# EAGLE design HABEXpico8 (EAGLE 9.1.3)

## Sheet 1 of 5
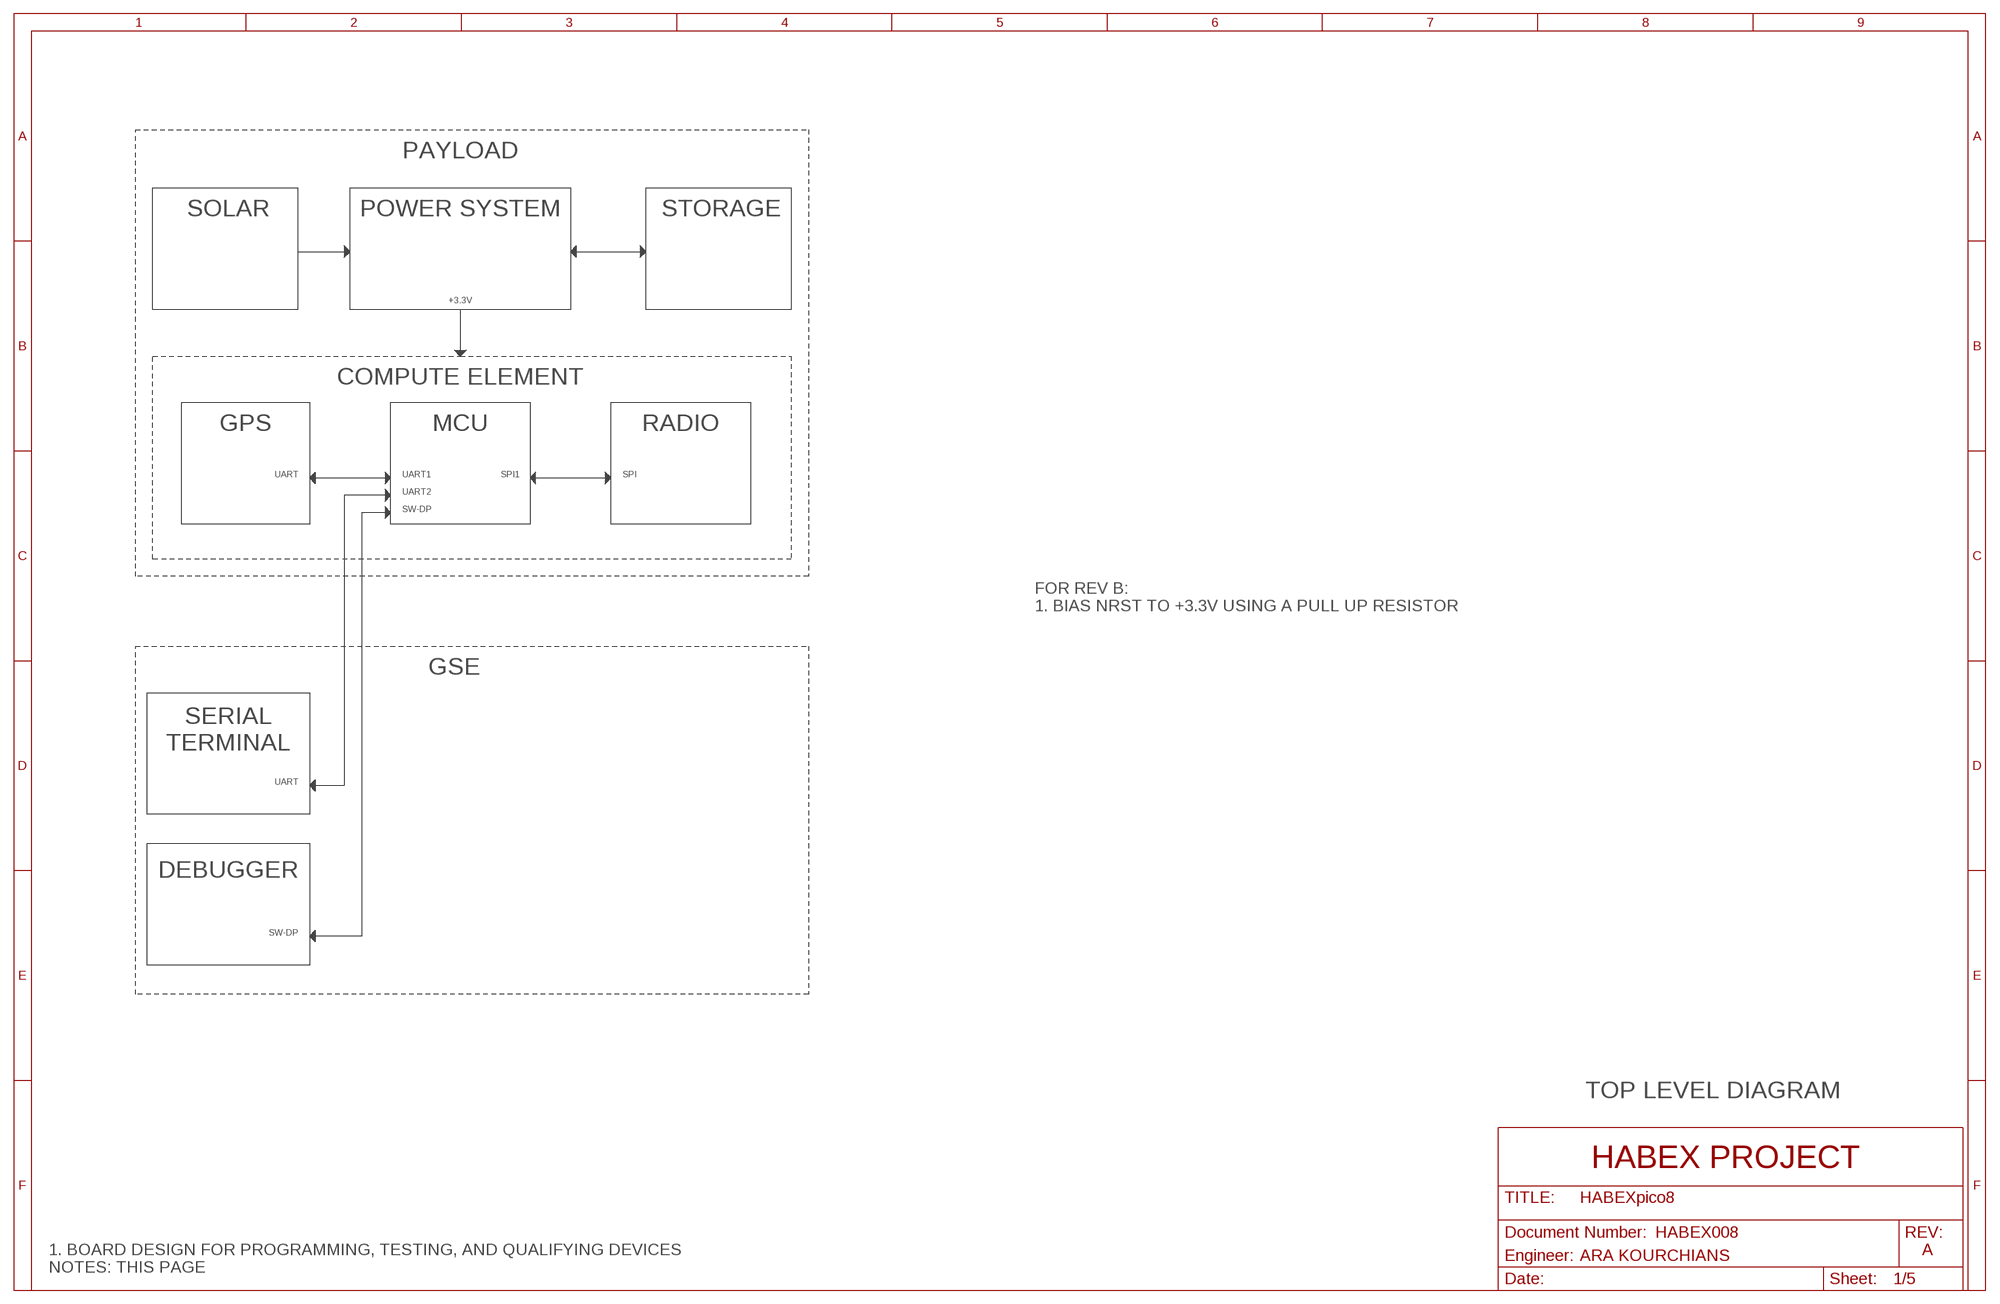
[diagram p0: schematic, sheet 1]

### Notes on the sheet
- PAYLOAD
- SOLAR | POWER SYSTEM | STORAGE
- +3.3V
- COMPUTE ELEMENT
- GPS | MCU | RADIO
- UART | UART1 | SPI1 | SPI
- UART2
- SW-DP
- FOR REV B:
  1. BIAS NRST TO +3.3V USING A PULL UP RESISTOR
- GSE
- SERIAL
  TERMINAL
- UART
- DEBUGGER
- SW-DP
- TOP LEVEL DIAGRAM
- HABEX PROJECT
- HABEX008
- A
- Engineer: | ARA KOURCHIANS
- 1. BOARD DESIGN FOR PROGRAMMING, TESTING, AND QUALIFYING DEVICES
  NOTES: THIS PAGE

## Sheet 2 of 5
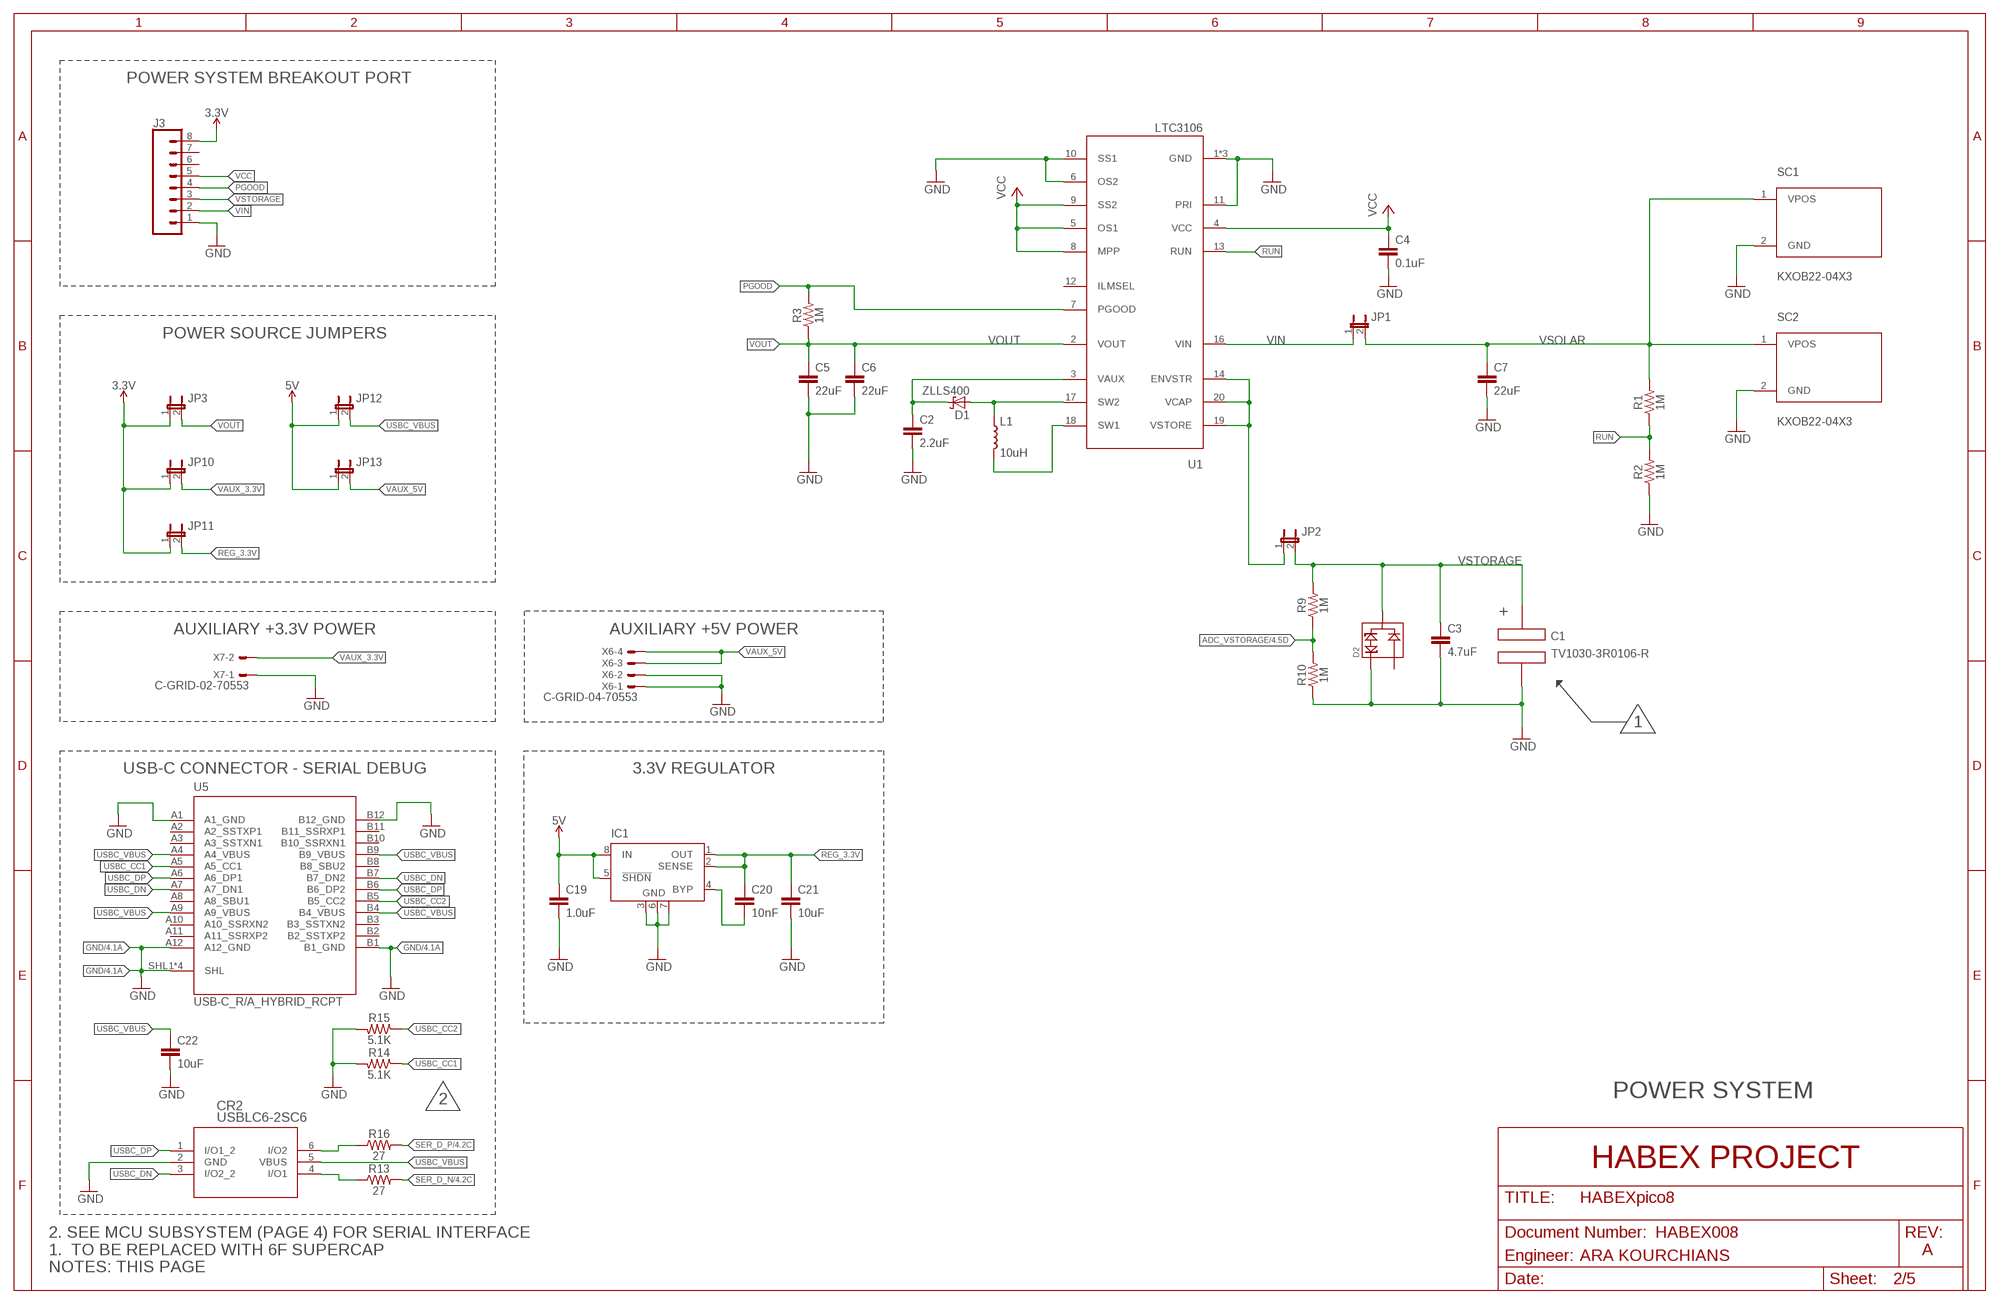
[diagram p1: schematic, sheet 2]

### Parts
C1  TV1030-3R0106-R  [5.0MM-SUPERCAP]
C2  2.2uF  2.2UF-0603-10V-20%  [0603]
C3  4.7uF  4.7UF0603  [0603]
C4  0.1uF  0.1UF-0603-25V-(+80/-20%)  [0603]
C5  22uF  22UF-0805-6.3V-20%  [0805]
C6  22uF  22UF-0805-6.3V-20%  [0805]
C7  22uF  22UF-0805-6.3V-20%  [0805]
C19  1.0uF  1.0UF-0603-16V-10%  [0603]
C20  10nF  10NF-0603-50V-10%  [0603]
C21  10uF  10UF-0603-6.3V-20%  [0603]
C22  10uF  10UF-0805-10V-10%  [0805]
CR2  USBLC6-2SC6  [SOT23-6L]
D1  ZLLS400  [SOD-323]
D2  SLVU2.8HTG  [SOT-23]
IC1  LT1763CS8-3.3  [SOIC8]
J3  CONN_08"  [1X08]
JP1  JUMPER-2PTH  [1X02]
JP2  JUMPER-2PTH  [1X02]
JP3  JUMPER-2PTH  [1X02]
JP10  JUMPER-2PTH  [1X02]
JP11  JUMPER-2PTH  [1X02]
JP12  JUMPER-2PTH  [1X02]
JP13  JUMPER-2PTH  [1X02]
L1  10uH  INDUCTOR-1210  [1210-INDUCTOR]
R1  1M  RESISTOR0603  [0603]
R2  1M  RESISTOR0603  [0603]
R3  1M  RESISTOR0603  [0603]
R9  1M  RESISTOR0603  [0603]
R10  1M  RESISTOR0603  [0603]
R13  27  27OHM-0603-1/10W-1%  [0603]
R14  5.1K  RESISTOR0603  [0603]
R15  5.1K  RESISTOR0603  [0603]
R16  27  27OHM-0603-1/10W-1%  [0603]
SC1  KXOB22-04X3  [KX0B22]
SC2  KXOB22-04X3  [KX0B22]
U1  LTC3106  [UDC20QFN]
U5  USB-C_R/A_HYBRID_RCPT  USB-C_R/A_HYBRID  [USB-C_R/A_HYBRID_RCPT]
X6  C-GRID-04-70553  [70553-04]
X7  C-GRID-02-70553  [70553-02]

### Nets
3.3V: J3.8 JP3.1 JP10.1 JP11.1 ; also sheet 3,4,5
5V: C19.1 IC1.5(!SHDN) IC1.8(IN) JP12.1 JP13.1 ; also sheet 4
ADC_VSTORAGE: R9.1 R10.2 ; also sheet 4
GND: C1.2(CAP_NEG) C2.2 C3.2 C4.2 C5.2 C6.2 C7.2 C19.2 C21.2 C22.2 CR2.2(GND) D2.1 IC1.3(GND) IC1.6(GND) IC1.7(GND) J3.1 R2.1 R10.1 R14.2 R15.2 SC1.2(GND) SC2.2(GND) U1.1(GND) U1.6(OS2) U1.10(SS1) U1.11(PRI) U1.15(GND) U1.21(GND) U5.A1(A1_GND) U5.A12(A12_GND) U5.B1(B1_GND) U5.B12(B12_GND) U5.SHL1(SHL) U5.SHL2(SHL) U5.SHL3(SHL) U5.SHL4(SHL) X6.1 X6.2 X7.1 ; also sheet 3,4,5
N$1: D1.A L1.1 U1.17(SW2)
N$2: L1.2 U1.18(SW1)
N$3: C2.1 D1.C U1.3(VAUX)
N$11: JP2.1 U1.14(ENVSTR) U1.19(VSTORE) U1.20(VCAP)
N$15: CR2.6(I/O2) R16.1
N$16: CR2.4(I/O1) R13.1
N$19: C20.2 IC1.4(BYP)
PGOOD: J3.4 R3.2 U1.7(PGOOD)
REG_3.3V: C20.1 C21.1 IC1.1(OUT) IC1.2(SENSE) JP11.2
RUN: R1.1 R2.2 U1.13(RUN)
SER_D_N [GPS_USB]: R13.2 ; also sheet 4
SER_D_P [GPS_USB]: R16.2 ; also sheet 4
USBC_CC1: R14.1 U5.A5(A5_CC1)
USBC_CC2: R15.1 U5.B5(B5_CC2)
USBC_DN: CR2.3(I/O2_2) U5.A7(A7_DN1) U5.B7(B7_DN2)
USBC_DP: CR2.1(I/O1_2) U5.A6(A6_DP1) U5.B6(B6_DP2)
USBC_VBUS: C22.1 CR2.5(VBUS) JP12.2 U5.A4(A4_VBUS) U5.A9(A9_VBUS) U5.B4(B4_VBUS) U5.B9(B9_VBUS)
VAUX_3.3V: JP10.2 X7.2
VAUX_5V: JP13.2 X6.3 X6.4
VCC: C4.1 J3.5 U1.4(VCC) U1.5(OS1) U1.8(MPP) U1.9(SS2)
VIN: J3.2 JP1.1 U1.16(VIN)
VOUT: C5.1 C6.1 JP3.2 R3.1 U1.2(VOUT)
VSOLAR: C7.1 JP1.2 R1.2 SC1.1(VPOS) SC2.1(VPOS)
VSTORAGE: C1.1(CAP_POS) C3.1 D2.3 J3.3 JP2.2 R9.2
Unconnected: J3.6 J3.7 U1.12(ILMSEL) U5.A2(A2_SSTXP1) U5.A3(A3_SSTXN1) U5.A8(A8_SBU1) U5.A10(A10_SSRXN2) U5.A11(A11_SSRXP2) U5.B2(B2_SSTXP2) U5.B3(B3_SSTXN2) U5.B8(B8_SBU2) U5.B10(B10_SSRXN1) U5.B11(B11_SSRXP1)

### Notes on the sheet
- POWER SYSTEM BREAKOUT PORT
- POWER SOURCE JUMPERS
- AUXILIARY +3.3V POWER | AUXILIARY +5V POWER
- 1
- USB-C CONNECTOR - SERIAL DEBUG | 3.3V REGULATOR
- POWER SYSTEM
- 2
- HABEX PROJECT
- HABEX008
- A
- Engineer: | ARA KOURCHIANS
- 2. SEE MCU SUBSYSTEM (PAGE 4) FOR SERIAL INTERFACE
  1.  TO BE REPLACED WITH 6F SUPERCAP
  NOTES: THIS PAGE

## Sheet 3 of 5
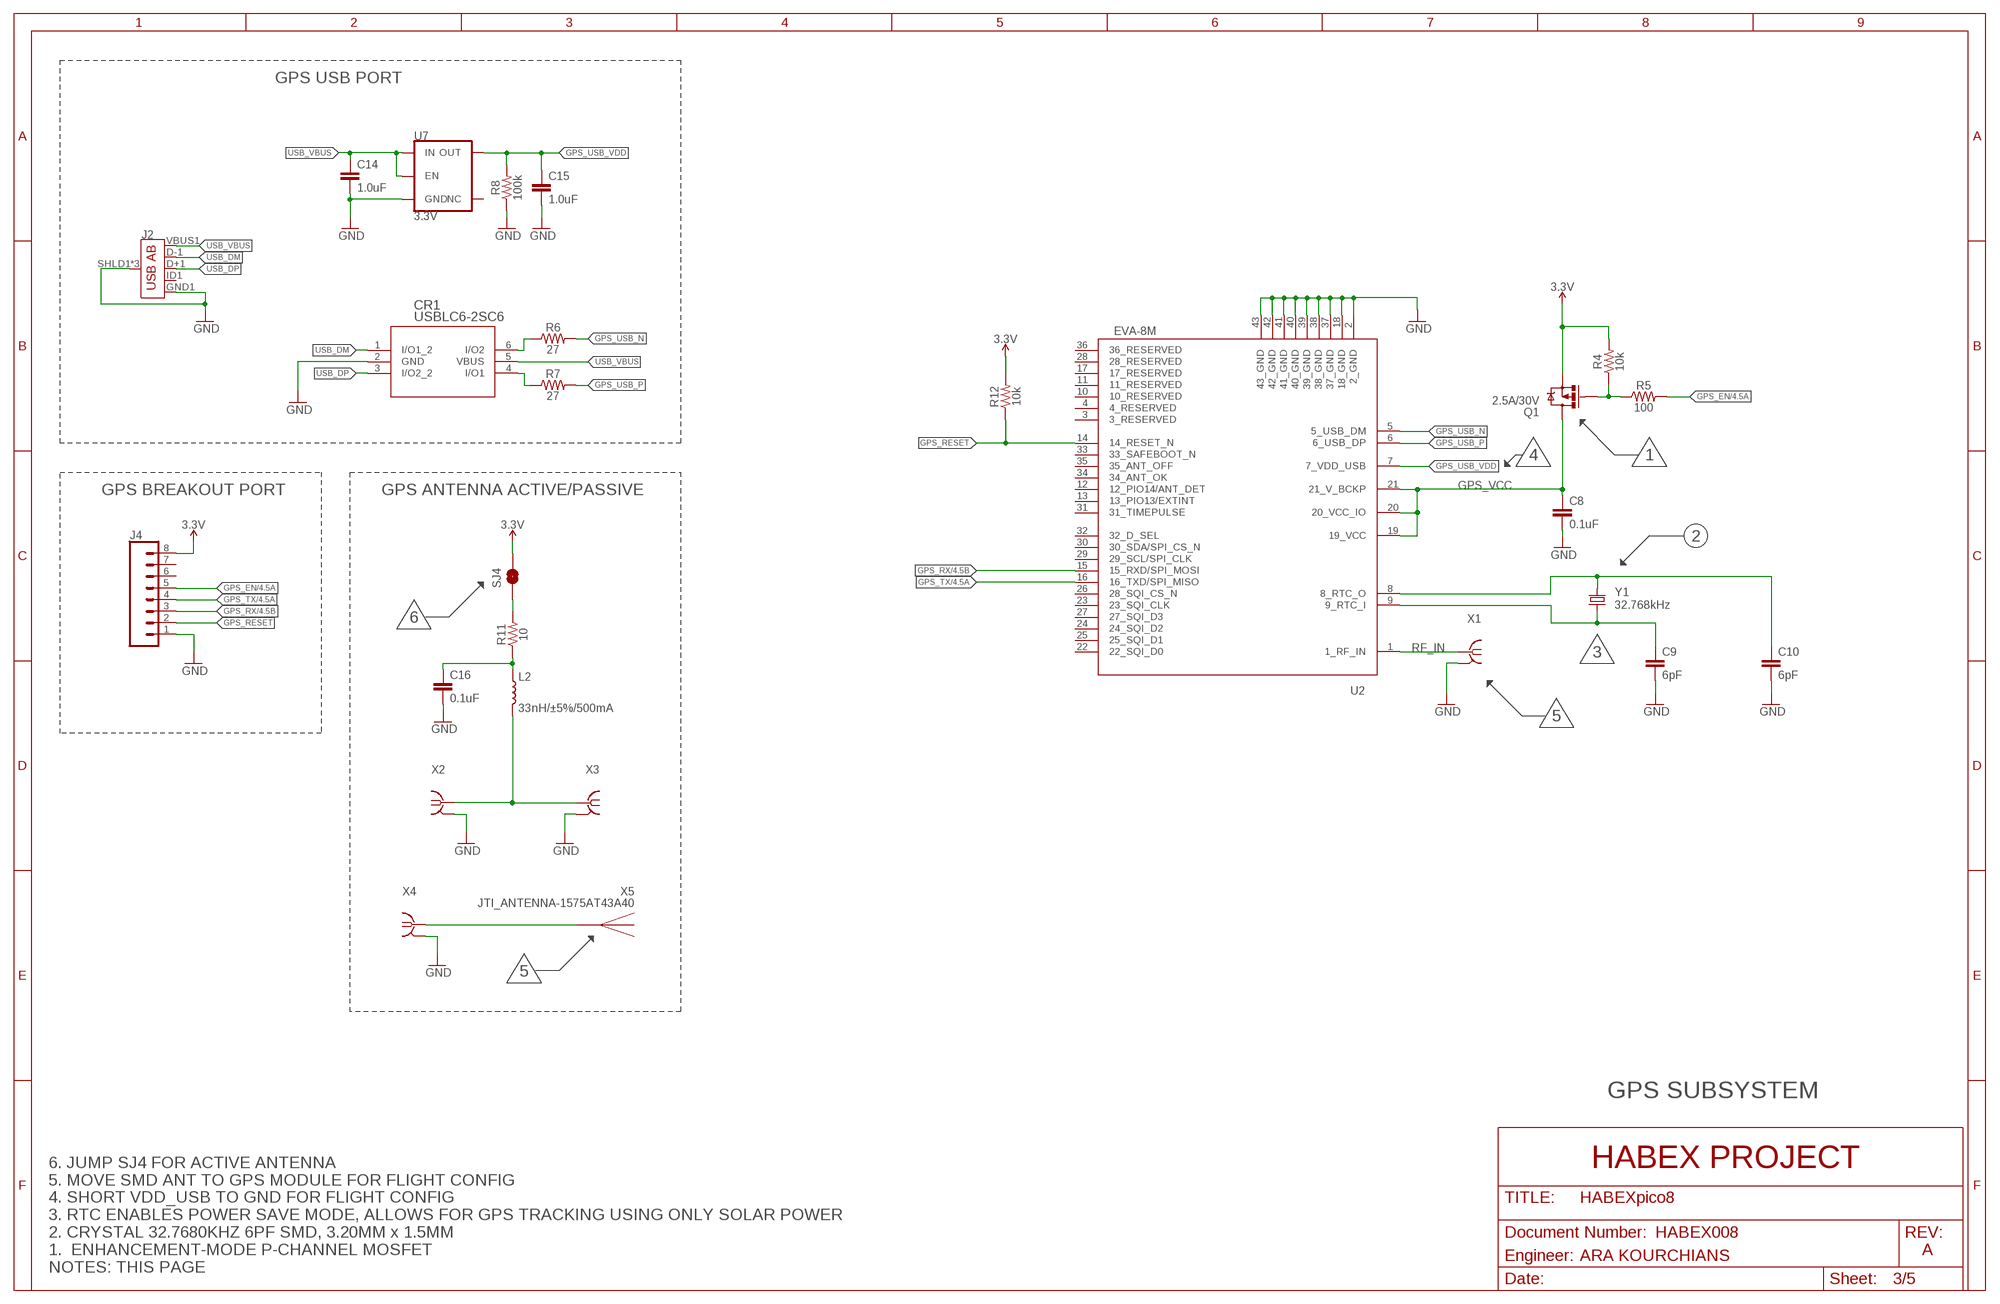
[diagram p2: schematic, sheet 3]

### Parts
C8  0.1uF  0.1UF-0603-25V-(+80/-20%)  [0603]
C9  6pF  C-EUC0603  [C0603]
C10  6pF  C-EUC0603  [C0603]
C14  1.0uF  1.0UF-0603-16V-10%  [0603]
C15  1.0uF  1.0UF-0603-16V-10%  [0603]
C16  0.1uF  0.1UF-0603-25V-5%  [0603]
CR1  USBLC6-2SC6  [SOT23-6L]
J2  USB_AB_SMT  [USB-AB-MICRO-SMD]
J4  CONN_08"  [1X08]
L2  33nH/±5%/500mA  INDUCTOR-0603-33NH  [0603]
Q1  2.5A/30V  MOSFET-PCHANNELDMG2307L  [SOT23-3]
R4  10k  10KOHM-0603-1/10W-1%  [0603]
R5  100  100OHM-0603-1/10W-1%  [0603]
R6  27  27OHM-0603-1/10W-1%  [0603]
R7  27  27OHM-0603-1/10W-1%  [0603]
R8  100k  100KOHM-0603-1/10W-1%  [0603]
R11  10  10OHM-1206-1/4W-1%  [1206]
R12  10k  10KOHM-0603-1/10W-1%  [0603]
SJ4  SOLDERJUMPERNO  [SJ_2S-NO]
U2  EVA-8M  [EVA-8M]
U7  3.3V  V_REG_AP2112K-3.3V  [SOT23-5]
X1  BU-SMA-V  [BU-SMA-V]
X2  BU-SMA-V  [BU-SMA-V]
X3  BU-SMA-V  [BU-SMA-V]
X4  BU-SMA-V  [BU-SMA-V]
X5  JTI_ANTENNA-1575AT43A40  [JTI_ANTENNA-1575AT43A40]
Y1  32.768kHz  CRYSTAL-32.768KHZSMD-3.2X1.5  [CRYSTAL-SMD-3.2X1.5MM]

### Nets
3.3V: J4.8 Q1.2(S) R4.2 R12.2 SJ4.2 ; also sheet 2,4,5
GND: C8.2 C9.2 C10.2 C14.2 C15.2 C16.2 CR1.2(GND) J2.GND1(GND) J2.SHLD1(SHIELD) J2.SHLD2(SHIELD) J2.SHLD3(SHIELD) J4.1 R8.1 U2.2(2_GND) U2.18(18_GND) U2.37(37_GND) U2.38(38_GND) U2.39(39_GND) U2.40(40_GND) U2.41(41_GND) U2.42(42_GND) U2.43(43_GND) U7.2(GND) X1.2 X1.3 X1.4 X1.5 X2.2 X2.3 X2.4 X2.5 X3.2 X3.3 X3.4 X3.5 X4.2 X4.3 X4.4 X4.5 ; also sheet 2,4,5
GPS_EN: J4.5 R5.2 ; also sheet 4
GPS_RESET: J4.2 R12.1 U2.14(14_RESET_N)
GPS_RX: J4.3 U2.15(15_RXD/SPI_MOSI) ; also sheet 4
GPS_TX: J4.4 U2.16(16_TXD/SPI_MISO) ; also sheet 4
GPS_USB_N: R6.2 U2.5(5_USB_DM)
GPS_USB_P: R7.2 U2.6(6_USB_DP)
GPS_USB_VDD: C15.1 R8.2 U2.7(7_VDD_USB) U7.5(OUT)
GPS_VCC: C8.1 Q1.3(D) U2.19(19_VCC) U2.20(20_VCC_IO) U2.21(21_V_BCKP)
N$4: X4.1 X5.FEED
N$5: Q1.1(G) R4.1 R5.1
N$6: C9.1 U2.9(9_RTC_I) Y1.P$1
N$7: C10.1 U2.8(8_RTC_O) Y1.P$2
N$8: CR1.6(I/O2) R6.1
N$9: CR1.4(I/O1) R7.1
N$12: C16.1 L2.1 R11.1
N$14: L2.2 X2.1 X3.1
N$25: R11.2 SJ4.1
RF_IN: U2.1(1_RF_IN) X1.1
USB_DM: CR1.1(I/O1_2) J2.D-1(D-)
USB_DP: CR1.3(I/O2_2) J2.D+1(D+)
USB_VBUS: C14.1 CR1.5(VBUS) J2.VBUS1(VBUS) U7.1(IN) U7.3(EN)
Unconnected: J2.ID1(USBID) J4.6 J4.7 U2.3(3_RESERVED) U2.4(4_RESERVED) U2.10(10_RESERVED) U2.11(11_RESERVED) U2.12(12_PIO14/ANT_DET) U2.13(13_PIO13/EXTINT) U2.17(17_RESERVED) U2.22(22_SQI_D0) U2.23(23_SQI_CLK) U2.24(24_SQI_D2) U2.25(25_SQI_D1) U2.26(28_SQI_CS_N) U2.27(27_SQI_D3) U2.28(28_RESERVED) U2.29(29_SCL/SPI_CLK) U2.30(30_SDA/SPI_CS_N) U2.31(31_TIMEPULSE) U2.32(32_D_SEL) U2.33(33_SAFEBOOT_N) U2.34(34_ANT_OK) U2.35(35_ANT_OFF) U2.36(36_RESERVED) U7.4(NC)

### Notes on the sheet
- GPS USB PORT
- 4 | 1
- GPS BREAKOUT PORT | GPS ANTENNA ACTIVE/PASSIVE
- 2
- 6
- 3
- 5
- 5
- GPS SUBSYSTEM
- HABEX PROJECT
- HABEX008
- A
- Engineer: | ARA KOURCHIANS
- 6. JUMP SJ4 FOR ACTIVE ANTENNA
  5. MOVE SMD ANT TO GPS MODULE FOR FLIGHT CONFIG 
  4. SHORT VDD_USB TO GND FOR FLIGHT CONFIG
  3. RTC ENABLES POWER SAVE MODE, ALLOWS FOR GPS TRACKING USING ONLY SOLAR POWER
  2. CRYSTAL 32.7680KHZ 6PF SMD, 3.20MM x 1.5MM
  1.  ENHANCEMENT-MODE P-CHANNEL MOSFET
  NOTES: THIS PAGE

## Sheet 4 of 5
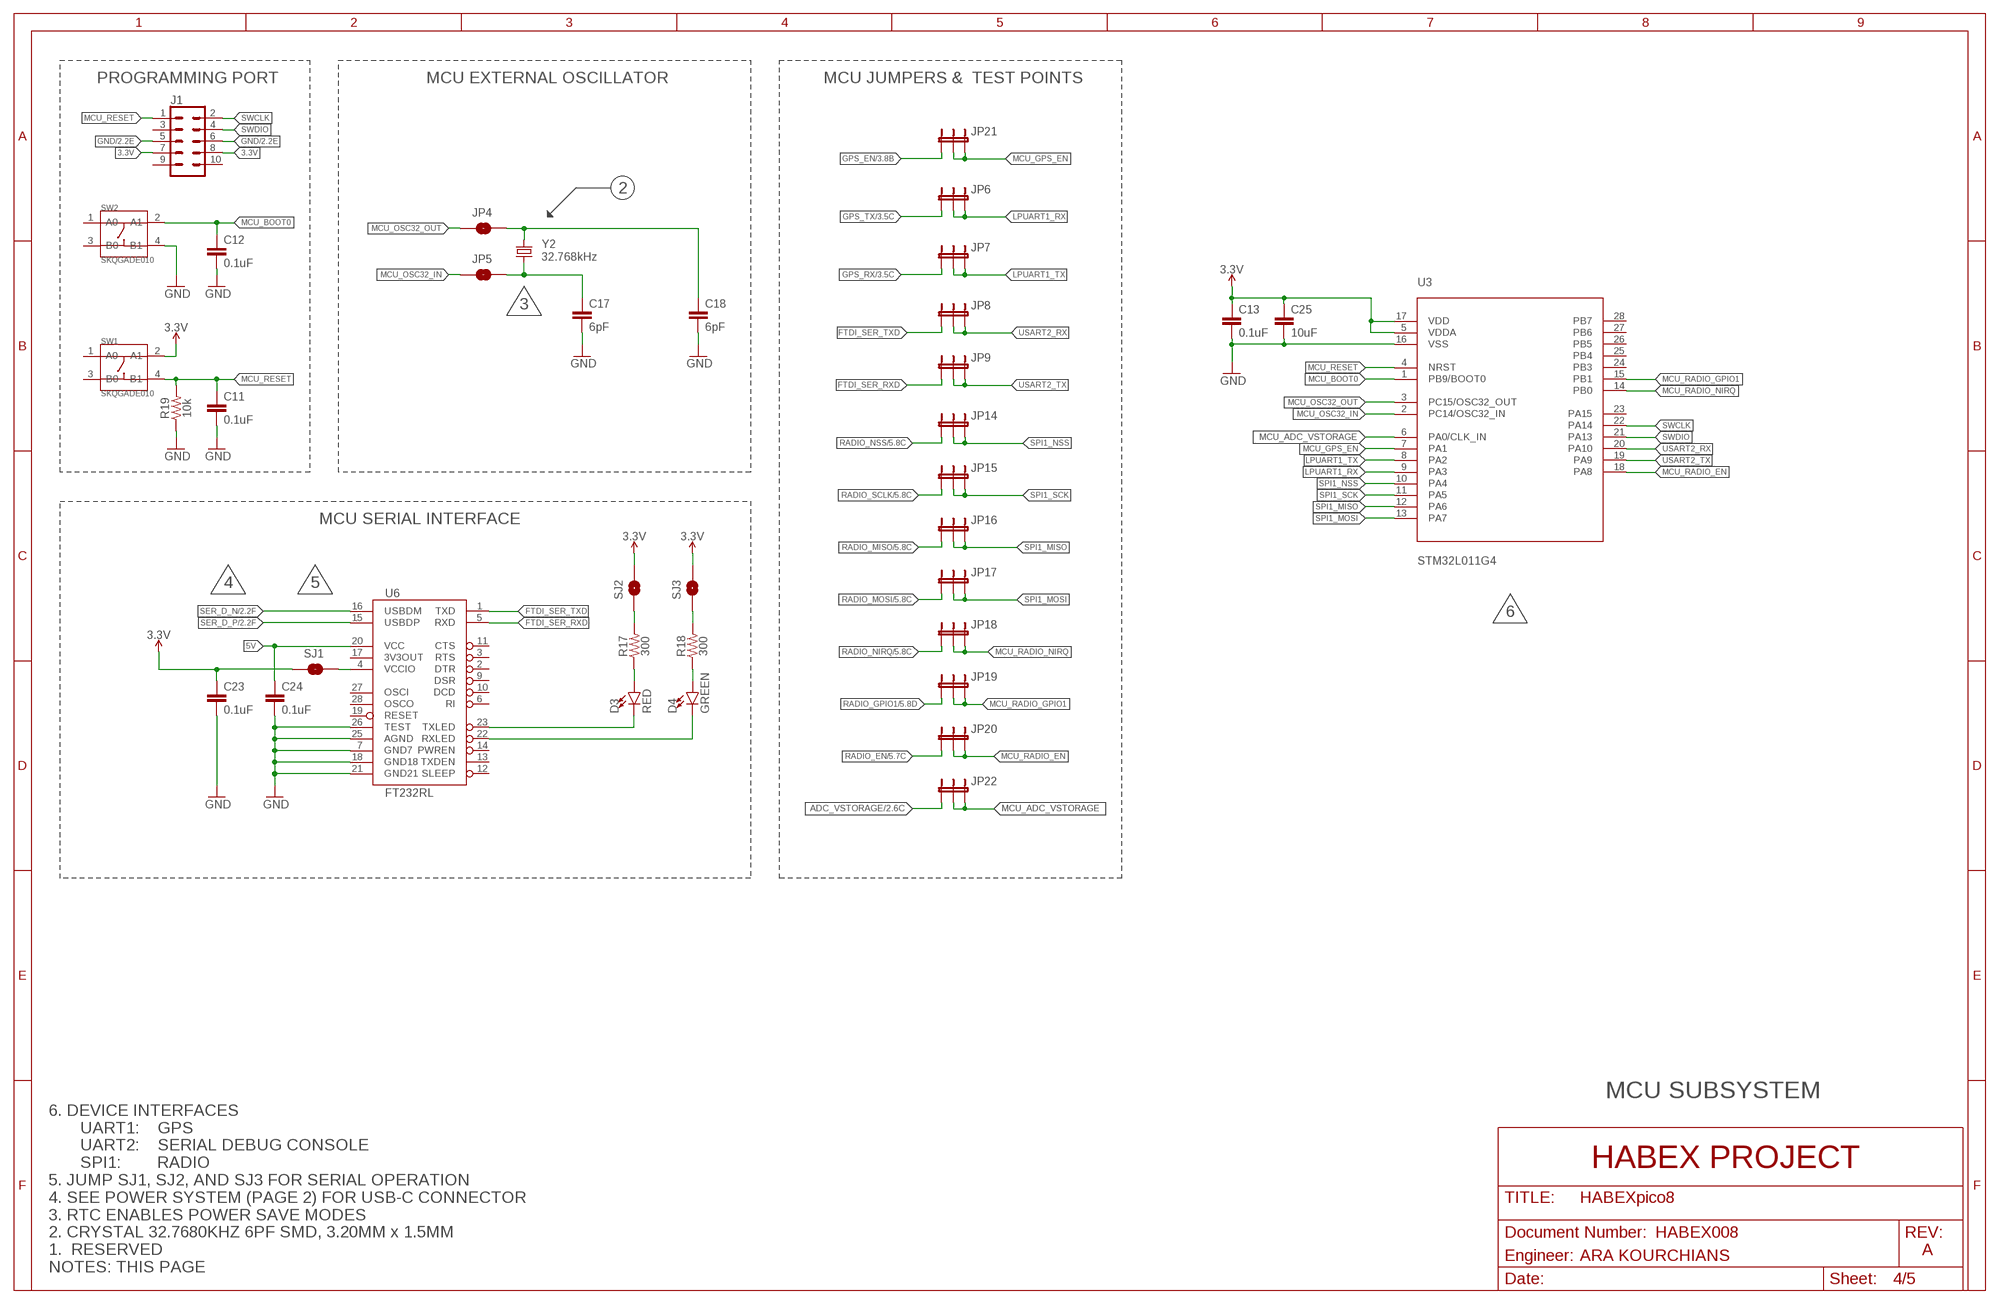
[diagram p3: schematic, sheet 4]

### Parts
C11  0.1uF  0.1UF-0603-25V-5%  [0603]
C12  0.1uF  0.1UF-0603-25V-5%  [0603]
C13  0.1uF  0.1UF-0603-25V-5%  [0603]
C17  6pF  C-EUC0603  [C0603]
C18  6pF  C-EUC0603  [C0603]
C23  0.1uF  0.1UF-0603-25V-5%  [0603]
C24  0.1uF  0.1UF-0603-25V-5%  [0603]
C25  10uF  10UF-0603-6.3V-20%  [0603]
D3  RED  LED-RED0603  [LED-0603]
D4  GREEN  LED-GREEN0603  [LED-0603]
J1  CONN_05X2SHD  [2X5-SHROUDED]
JP4  JUMPER-SMT_2_NO_SILK  [SMT-JUMPER_2_NO_SILK]
JP5  JUMPER-SMT_2_NO_SILK  [SMT-JUMPER_2_NO_SILK]
JP6  JUMPER-3PTH  [1X03]
JP7  JUMPER-3PTH  [1X03]
JP8  JUMPER-3PTH  [1X03]
JP9  JUMPER-3PTH  [1X03]
JP14  JUMPER-3PTH  [1X03]
JP15  JUMPER-3PTH  [1X03]
JP16  JUMPER-3PTH  [1X03]
JP17  JUMPER-3PTH  [1X03]
JP18  JUMPER-3PTH  [1X03]
JP19  JUMPER-3PTH  [1X03]
JP20  JUMPER-3PTH  [1X03]
JP21  JUMPER-3PTH  [1X03]
JP22  JUMPER-3PTH  [1X03]
R17  300  300OHM-0603-1/10W-1%  [0603]
R18  300  300OHM-0603-1/10W-1%  [0603]
R19  10k  10KOHM-0603-1/10W-1%  [0603]
SJ1  SOLDERJUMPERNO  [SJ_2S-NO]
SJ2  SOLDERJUMPERNO  [SJ_2S-NO]
SJ3  SOLDERJUMPERNO  [SJ_2S-NO]
SW1  SKQGADE010  SMD-BUTTON(4P-5.2X5.2X1.5MM-SKQGADE010)-SKQGADE010  [SW4-SMD-5.2X5.2X1.5MM]
SW2  SKQGADE010  SMD-BUTTON(4P-5.2X5.2X1.5MM-SKQGADE010)-SKQGADE010  [SW4-SMD-5.2X5.2X1.5MM]
U3  STM32L011G4  [UFQFPN28]
U6  FT232RL  FT232RLSSOP  [SSOP28DB]
Y2  32.768kHz  CRYSTAL-32.768KHZSMD-3.2X1.5  [CRYSTAL-SMD-3.2X1.5MM]

### Nets
3.3V: C13.1 C23.1 C25.1 J1.7 J1.8 SJ1.1 SJ2.2 SJ3.2 SW1.2(A1) U3.5(VDDA) U3.17(VDD) ; also sheet 2,3,5
5V: C24.1 U6.20(VCC) ; also sheet 2
ADC_VSTORAGE: JP22.1 ; also sheet 2
FTDI_SER_RXD: JP9.1 U6.5(RXD)
FTDI_SER_TXD: JP8.1 U6.1(TXD)
GND: C11.2 C12.2 C13.2 C17.2 C18.2 C23.2 C24.2 C25.2 J1.5 J1.6 R19.1 SW2.4(B1) U3.16(VSS) U6.7(GND7) U6.18(GND18) U6.21(GND21) U6.25(AGND) U6.26(TEST) ; also sheet 2,3,5
GPS_EN: JP21.1 ; also sheet 3
GPS_RX: JP7.1 ; also sheet 3
GPS_TX: JP6.1 ; also sheet 3
LPUART1_RX: JP6.2 JP6.3 U3.9(PA3)
LPUART1_TX: JP7.2 JP7.3 U3.8(PA2)
MCU_ADC_VSTORAGE: JP22.2 JP22.3 U3.6(PA0/CLK_IN)
MCU_BOOT0: C12.1 SW2.2(A1) U3.1(PB9/BOOT0)
MCU_GPS_EN: JP21.2 JP21.3 U3.7(PA1)
MCU_OSC32_IN: JP5.1 U3.2(PC14/OSC32_IN)
MCU_OSC32_OUT: JP4.1 U3.3(PC15/OSC32_OUT)
MCU_RADIO_EN: JP20.2 JP20.3 U3.18(PA8)
MCU_RADIO_GPIO1: JP19.2 JP19.3 U3.15(PB1)
MCU_RADIO_NIRQ: JP18.2 JP18.3 U3.14(PB0)
MCU_RESET: C11.1 J1.1 R19.2 SW1.4(B1) U3.4(NRST)
N$10: C17.1 JP5.2 Y2.P$1
N$13: C18.1 JP4.2 Y2.P$2
N$17: D3.C U6.23(TXLED)
N$18: D4.C U6.22(RXLED)
N$20: D3.A R17.1
N$21: D4.A R18.1
N$22: SJ1.2 U6.4(VCCIO)
N$23: R17.2 SJ2.1
N$24: R18.2 SJ3.1
RADIO_EN: JP20.1 ; also sheet 5
RADIO_GPIO1: JP19.1 ; also sheet 5
RADIO_MISO: JP16.1 ; also sheet 5
RADIO_MOSI: JP17.1 ; also sheet 5
RADIO_NIRQ: JP18.1 ; also sheet 5
RADIO_NSS: JP14.1 ; also sheet 5
RADIO_SCLK: JP15.1 ; also sheet 5
SER_D_N [GPS_USB]: U6.16(USBDM) ; also sheet 2
SER_D_P [GPS_USB]: U6.15(USBDP) ; also sheet 2
SPI1_MISO: JP16.2 JP16.3 U3.12(PA6)
SPI1_MOSI: JP17.2 JP17.3 U3.13(PA7)
SPI1_NSS: JP14.2 JP14.3 U3.10(PA4)
SPI1_SCK: JP15.2 JP15.3 U3.11(PA5)
SWCLK: J1.2 U3.22(PA14)
SWDIO: J1.4 U3.21(PA13)
USART2_RX: JP8.2 JP8.3 U3.20(PA10)
USART2_TX: JP9.2 JP9.3 U3.19(PA9)
Unconnected: J1.3 J1.9 J1.10 SW1.1(A0) SW1.3(B0) SW2.1(A0) SW2.3(B0) U3.23(PA15) U3.24(PB3) U3.25(PB4) U3.26(PB5) U3.27(PB6) U3.28(PB7) U6.2(DTR) U6.3(RTS) U6.6(RI) U6.9(DSR) U6.10(DCD) U6.11(CTS) U6.12(SLEEP) U6.13(TXDEN) U6.14(PWREN) U6.17(3V3OUT) U6.19(RESET) U6.27(OSCI) U6.28(OSCO)

### Notes on the sheet
- PROGRAMMING PORT | MCU EXTERNAL OSCILLATOR | MCU JUMPERS &  TEST POINTS
- 2
- 3
- MCU SERIAL INTERFACE
- 4 | 5
- 6
- MCU SUBSYSTEM
- HABEX PROJECT
- HABEX008
- A
- Engineer: | ARA KOURCHIANS
- 6. DEVICE INTERFACES
         UART1:    GPS
         UART2:    SERIAL DEBUG CONSOLE
         SPI1:        RADIO
  5. JUMP SJ1, SJ2, AND SJ3 FOR SERIAL OPERATION
  4. SEE POWER SYSTEM (PAGE 2) FOR USB-C CONNECTOR
  3. RTC ENABLES POWER SAVE MODES
  2. CRYSTAL 32.7680KHZ 6PF SMD, 3.20MM x 1.5MM
  1.  RESERVED
  NOTES: THIS PAGE

## Sheet 5 of 5
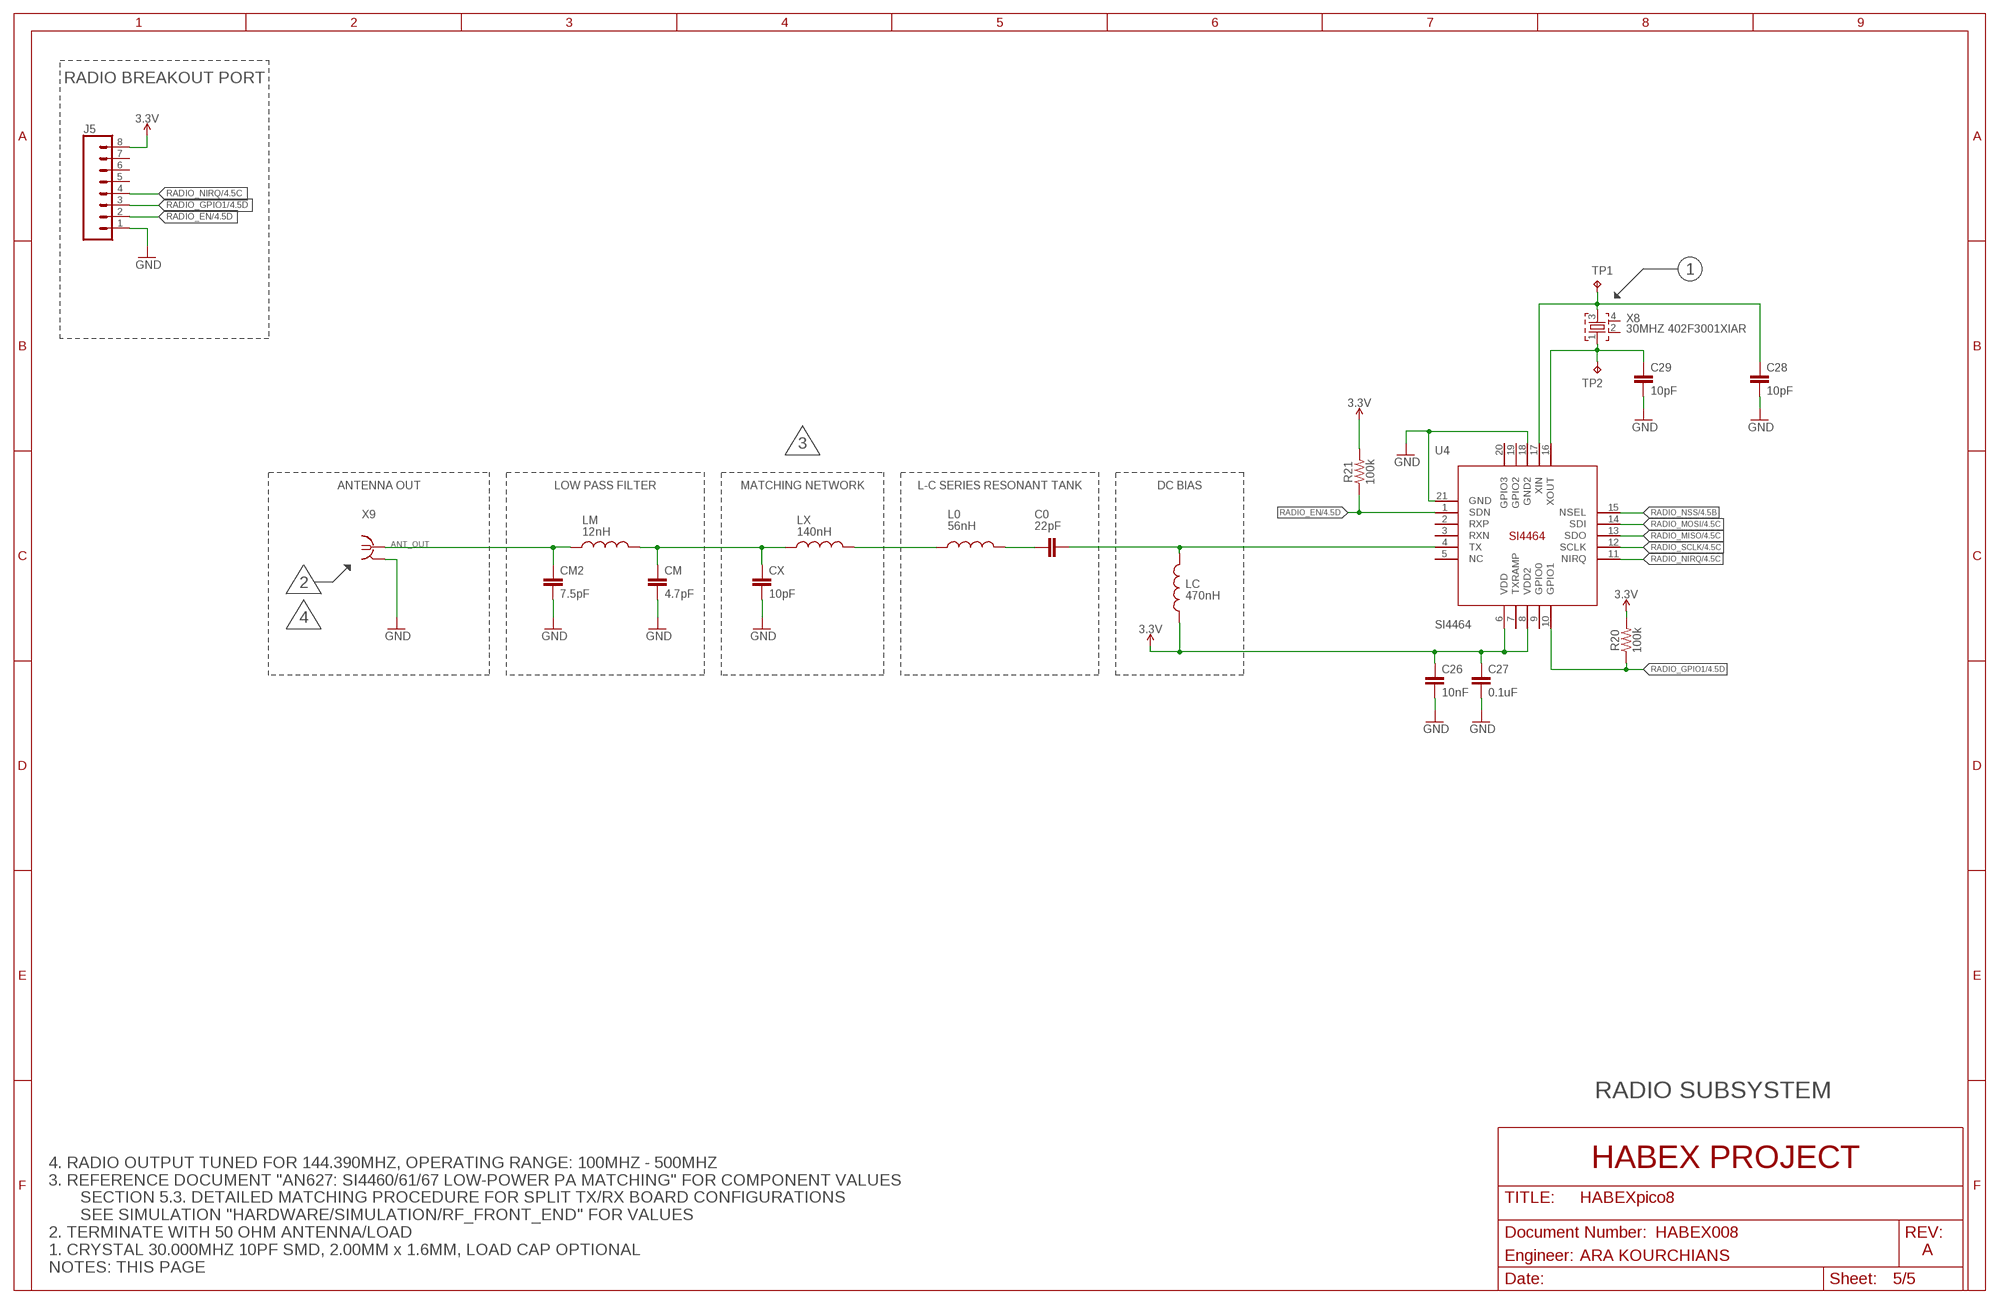
[diagram p4: schematic, sheet 5]

### Parts
C0  22pF  CAPACITOR_0603_L  [RESC0603_L]
C26  10nF  10NF-0603-50V-10%  [0603]
C27  0.1uF  0.1UF-0603-25V-5%  [0603]
C28  10pF  10PF-0603-50V-5%  [0603]
C29  10pF  10PF-0603-50V-5%  [0603]
CM  4.7pF  CAPACITOR_0603_L  [RESC0603_L]
CM2  7.5pF  CAPACITOR_0603_L  [RESC0603_L]
CX  10pF  CAPACITOR_0603_L  [RESC0603_L]
J5  CONN_08"  [1X08]
L0  56nH  INDUCTOR_0603_L  [RESC0603_L]
LC  470nH  INDUCTOR_0603_L  [RESC0603_L]
LM  12nH  INDUCTOR_0603_L  [RESC0603_L]
LX  140nH  INDUCTOR_0603_L  [RESC0603_L]
R20  100k  100KOHM-0603-1/10W-1%  [0603]
R21  100k  100KOHM-0603-1/10W-1%  [0603]
TP1  TPPAD1-13  [P1-13]
TP2  TPPAD1-13  [P1-13]
U4  SI4464  [QFN20+GNDPAD]
X8  30MHZ 402F3001XIAR  CRYSTALS-GND-LID-IQXC-42  [2.0X1.6-4-PAD]
X9  BU-SMA-V  [BU-SMA-V]

### Nets
3.3V: C26.1 C27.1 J5.8 LC.1 R20.2 R21.2 U4.6(VDD) U4.8(VDD2) ; also sheet 2,3,4
ANT_OUT: CM2.1 LM.1 X9.1
GND: C26.2 C27.2 C28.2 C29.2 CM2.2 CM.2 CX.2 J5.1 U4.18(GND2) U4.21(GND) X9.2 X9.3 X9.4 X9.5 ; also sheet 2,3,4
N$26: C28.1 TP1.TP U4.17(XIN) X8.3
N$27: C29.1 TP2.TP U4.16(XOUT) X8.1
N$28: C0.1 LC.2 U4.4(TX)
N$29: L0.1 LX.2
N$30: C0.2 L0.2
N$31: CM.1 CX.1 LM.2 LX.1
RADIO_EN: J5.2 R21.1 U4.1(SDN) ; also sheet 4
RADIO_GPIO1: J5.3 R20.1 U4.10(GPIO1) ; also sheet 4
RADIO_MISO: U4.13(SDO) ; also sheet 4
RADIO_MOSI: U4.14(SDI) ; also sheet 4
RADIO_NIRQ: J5.4 U4.11(NIRQ) ; also sheet 4
RADIO_NSS: U4.15(NSEL) ; also sheet 4
RADIO_SCLK: U4.12(SCLK) ; also sheet 4
Unconnected: J5.5 J5.6 J5.7 U4.2(RXP) U4.3(RXN) U4.5(NC ) U4.7(TXRAMP) U4.9(GPIO0) U4.19(GPIO2) U4.20(GPIO3) X8.2 X8.4

### Notes on the sheet
- RADIO BREAKOUT PORT
- 1
- 3
- ANTENNA OUT | LOW PASS FILTER | MATCHING NETWORK | L-C SERIES RESONANT TANK | DC BIAS
- 2
- 4
- RADIO SUBSYSTEM
- HABEX PROJECT
- HABEX008
- A
- Engineer: | ARA KOURCHIANS
- 4. RADIO OUTPUT TUNED FOR 144.390MHZ, OPERATING RANGE: 100MHZ - 500MHZ
  3. REFERENCE DOCUMENT "AN627: SI4460/61/67 LOW-POWER PA MATCHING" FOR COMPONENT VALUES
         SECTION 5.3. DETAILED MATCHING PROCEDURE FOR SPLIT TX/RX BOARD CONFIGURATIONS
         SEE SIMULATION "HARDWARE/SIMULATION/RF_FRONT_END" FOR VALUES 
  2. TERMINATE WITH 50 OHM ANTENNA/LOAD
  1. CRYSTAL 30.000MHZ 10PF SMD, 2.00MM x 1.6MM, LOAD CAP OPTIONAL
  NOTES: THIS PAGE

## Power pins joined to a net without a drawn wire
2: D2.2

## Library data of the parts
C0 CM CM2 CX = Nordic_nRF:CAPACITOR: Generic chip capacitor
C1 = habexpico8:TV1030-3R0106-R: 10F Supercapacitor
C2 = SparkFun-Capacitors:2.2UF: 2.2µF ceramic capacitors A capacitor is a passive two-terminal electrical component used to store electrical energy temporarily in an electric field.; PROD_ID: CAP-07888
C3 = SparkFun-Capacitors:4.7UF: 4.7µF ceramic capacitors A capacitor is a passive two-terminal electrical component used to store electrical energy temporarily in an electric field.; PROD_ID: CAP-08280
C4 C8 = SparkFun-Capacitors:0.1UF: 0.1µF ceramic capacitors A capacitor is a passive two-terminal electrical component used to store electrical energy temporarily in an electric field.; PROD_ID: CAP-00810
C5-C7 = SparkFun-Capacitors:22UF: 22µF ceramic capacitors A capacitor is a passive two-terminal electrical component used to store electrical energy temporarily in an electric field.; PROD_ID: CAP-08402
C9 C10 C17 C18 = rcl:C-EU: CAPACITOR, European symbol; SPICEPREFIX: C
C11-C13 C16 C23 C24 C27 = SparkFun-Capacitors:0.1UF: 0.1µF ceramic capacitors A capacitor is a passive two-terminal electrical component used to store electrical energy temporarily in an electric field.; PROD_ID: CAP-08604
C14 C15 C19 = SparkFun-Capacitors:1.0UF: 1µF ceramic capacitors A capacitor is a passive two-terminal electrical component used to store electrical energy temporarily in an electric field.; PROD_ID: CAP-00868
C20 C26 = SparkFun-Capacitors:10NF: 0.01uF/10nF/10,000pF ceramic capacitors A capacitor is a passive two-terminal electrical component used to store electrical energy temporarily in an electric field. CAP-09321; PROD_ID: CAP-00867
C21 C25 = SparkFun-Capacitors:10UF: 10.0µF ceramic capacitors A capacitor is a passive two-terminal electrical component used to store electrical energy temporarily in an electric field.; PROD_ID: CAP-11015
C22 = SparkFun-Capacitors:10UF: 10.0µF ceramic capacitors A capacitor is a passive two-terminal electrical component used to store electrical energy temporarily in an electric field.; PROD_ID: CAP-11330
C28 C29 = SparkFun-Capacitors:10PF: 10pF ceramic capacitors A capacitor is a passive two-terminal electrical component used to store electrical energy temporarily in an electric field.; PROD_ID: CAP-11812
CR1 CR2 = habexpico8:USBLC6-2SC6; MANUFACTURER_PART_NUMBER: USBLC62SC6; VENDOR: ST Microelectronics
D1 = habexpico8:ZLLS400: SCHOTTKY DIODE, ZLLS400
D2 = habexpico8:SLVU2.8HTG: TVS Diode
D3 = SparkFun-LED:LED-RED: Red SMD LED Used in manufacturing of most products at SparkFun Packages: 0603 - SMD 0603 package [Product Link] <http://docs.avagotech.com/docs/AV02-0551EN> 0603 SMART - SMD 0603 SMART package ( more efficient and expensive)[Product Link] <http://www.osram-os.com/Graphics/XPic2/00077099_0.pdf> 1206 - SMD1206 package [Product Link] <https://www.sparkfun.com/datasheets/DevTools/LilyPad/Q150OVS4.pdff> SparkFun Products: Pro Mini 328 -5V <https://www.sparkfun.com/products/821> RedBoard <https://www.sparkfun.com/products/12757> IOIO-OTG <https://www.sparkfun.com/products/13613>; PROD_ID: DIO-00819
D4 = SparkFun-LED:LED-GREEN: Green SMD LED Used in manufacturing of various products at SparkFun Packages: 0603 - SMD 0603 package [Product Link] <http://www.futureelectronics.com/en/technologies/semiconductors/optoelectronics/leds/Pages/9894312-LTST-C190GKT.aspx?CrossPart=HSMG-C190&IM=0> LilyPad 1206 - SMD1206 LilyPad package [Product Link] <http://www.futureelectronics.com/en/Technologies/Product.aspx?ProductID=IN150NGHARVATEKCORPORATION2049943&IM=0> 1206 - SMD1206 package [Product Link] <http://www.futureelectronics.com/en/technologies/semiconductors/optoelectronics/leds/Pages/8315665-LTST-C150KGKT.aspx?IM=0> 1206 Bottom Mount -SMD 1206 Bottom Mount [Product Link] <http://www.digikey.com/product-detail/en/lite-on-inc/LTST-C230KGKT/160-1456-1-ND/386854> SparkFun Products: Pro Mini 328 -5V <https://www.sparkfun.com/products/821> RedBoard <https://www.sparkfun.com/products/12757> MP3 Trigger <https://www.sparkfun.com/products/13720> Makey Makey <https://www.sparkfun.com/products/11076>; PROD_ID: DIO-00821
IC1 = linear-technology:LT1763CS8: 500mA, Low Noise, LDO Micropower Regulators Source: http://cds.linear.com/docs/Datasheet/1763ff.pdf; MPN: LT1763CS8-3.3; OC_FARNELL: 1273617; OC_NEWARK: 57M6055
J1 = SparkFun-Connectors:CONN_05X2: Multi connection point. Often used as Generic Header-pin footprint for 0.1 inch spaced/style header connections For AVR SPI programming port, see special device with nice symbol: "AVR_SPI_PROG_5x2.dev" You can populate with any combo of single row headers, but if you'd like an exact match, check these: 2x5 AVR ICSP Male Header <https://www.sparkfun.com/products/778> (PRT-00778) 2x5 Pin Shrouded Header <https://www.sparkfun.com/products/8506> (PRT-08506) On any of the 0.1 inch spaced packages, you can populate with these: Break Away Headers - Straight <https://www.sparkfun.com/products/116> (PRT-00116) Break Away Male Headers - Right Angle <https://www.sparkfun.com/products/553> (PRT-00553) Female Headers <https://www.sparkfun.com/products/115> (PRT-00115) Break Away Headers - Machine Pin <https://www.sparkfun.com/products/117> (PRT-00117) Break Away Female Headers - Swiss Machine Pin <https://www.sparkfun.com/products/743> (PRT-00743) Special note: the shrouded connector mates well with our 5x2 ribbon cables: 2x5 Pin IDC Ribbon Cable <https://www.sparkfun.com/products/8535> (PRT-08535); PROD_ID: CONN-08671; SF_ID: PRT-08506
J2 = SparkFun-Connectors:USB_AB: USB Type AB Micro Connector OTG-compatible. 5 pins, 3 shield pins SparkFun Products: IOIO-OTG <https://www.sparkfun.com/products/13613> SparkFun SAMD21 Mini Breakout <https://www.sparkfun.com/products/13664>; PROD_ID: CONN-11794
J3-J5 = SparkFun-Connectors:CONN_08: Multi connection point. Often used as Generic Header-pin footprint for 0.1 inch spaced/style header connections On any of the 0.1 inch spaced packages, you can populate with these: Break Away Headers - Straight <https://www.sparkfun.com/products/116> (PRT-00116) Break Away Male Headers - Right Angle <https://www.sparkfun.com/products/553> (PRT-00553) Female Headers <https://www.sparkfun.com/products/115> (PRT-00115) Break Away Headers - Machine Pin <https://www.sparkfun.com/products/117> (PRT-00117) Break Away Female Headers - Swiss Machine Pin <https://www.sparkfun.com/products/743> (PRT-00743) Arduino Stackable Header - 8 Pin <https://www.sparkfun.com/products/9279> (PRT-09279) For SCREWTERMINALS and SPRING TERMINALS visit here: Screw Terimnals on SparkFun.com <https://www.sparkfun.com/search/results?term=Screw+Terminals> (5mm/3.5mm/2.54mm spacing) This device is also useful as a general connection point to wire up your design to another part of your project. Our various solder wires solder well into these plated through hole pads. Hook-Up Wire - Assortment (Stranded, 22 AWG) <https://www.sparkfun.com/products/11375> (PRT-11375) Hook-Up Wire - Assortment (Solid Core, 22 AWG) <https://www.sparkfun.com/products/11367> (PRT-11367) View the entire wire category on our website here <https://www.sparkfun.com/categories/141> Special notes: Molex polarized connector foot print use with SKU : PRT-08231 with associated crimp pins and housings. 1MM SMD Version SKU: PRT-10208 NOTES ON THE VARIANTS LOCK and LOCK_LONGPADS... This footprint was designed to help hold the alignment of a through-hole component (i.e. 6-pin header) while soldering it into place. You may notice that each hole has been shifted either up or down by 0.005 of an inch from it's more standard position (which is a perfectly straight line). This slight alteration caused the pins (the squares in the middle) to touch the edges of the holes. Because they are alternating, it causes a "brace" to hold the component in place. 0.005 has proven to be the perfect amount of "off-center" position when using our standard breakaway headers. Although looks a little odd when you look at the bare footprint, once you have a header in there, the alteration is very hard to notice. Also,if you push a header all the way into place, it is covered up entirely on the bottom side.; PROD_ID: CONN-08438
JP1-JP3 JP10-JP13 = SparkFun-Retired:JUMPER-2: Jumper Basic 0.1" spaced jumper. Use with breakaway headers.
JP4 JP5 = SparkFun-Jumpers:JUMPER-SMT_2_NO: Normally open jumper This jumper has two pads in close proximity to each other. Apply solder to close the connection. Round pads are easier to solder for beginners, but are a lot larger. SparkFun Product that uses the round pads: SparkFun EL Sequencer <https://www.sparkfun.com/products/12781>
JP6-JP9 JP14-JP22 = SparkFun-Retired:JUMPER-3
L0 LC LM LX = Nordic_nRF:INDUCTOR: Generic chip inductor
L1 = habexpico8:INDUCTOR-1210: Inductor, 1210 Package
L2 = SparkFun-Coils:INDUCTOR: Inductors Resist changes in electrical current. Basically a coil of wire. SparkFun Products: SparkFun Load Cell Amplifier - HX711 <https://www.sparkfun.com/products/13879> IOIO-OTG - V2.2 <https://www.sparkfun.com/products/13613>; PROD_ID: NDUC-07874
Q1 = User-Submitted:MOSFET-PCHANNEL: Generic PMOSFET IRLML2244 - TRANS-11153 (SOT-23 -20V -4.3A) (1.Gate 2.Source 3.Drain) FQP27P06 - COM-10349 <http://www.sparkfun.com/products/10349> (TO-220 -60V -27A) (1.Gate 2.Source 3.Drain); PROD_ID: TRANS-11308
R1-R3 R9 R10 R14 R15 = SparkFun-Resistors:RESISTOR: Generic Resistor Package
R4 R12 R19 = SparkFun-Resistors:10KOHM: 10kΩ resistor A resistor is a passive two-terminal electrical component that implements electrical resistance as a circuit element. Resistors act to reduce current flow, and, at the same time, act to lower voltage levels within circuits. - Wikipedia; PROD_ID: RES-00824
R5 = SparkFun-Resistors:100OHM: 100Ω resistor A resistor is a passive two-terminal electrical component that implements electrical resistance as a circuit element. Resistors act to reduce current flow, and, at the same time, act to lower voltage levels within circuits. - Wikipedia; PROD_ID: RES-07863
R6 R7 R13 R16 = SparkFun-Resistors:27OHM: 27Ω resistor A resistor is a passive two-terminal electrical component that implements electrical resistance as a circuit element. Resistors act to reduce current flow, and, at the same time, act to lower voltage levels within circuits. - Wikipedia; PROD_ID: RES-09334
R8 R20 R21 = SparkFun-Resistors:100KOHM: 100kΩ resistor A resistor is a passive two-terminal electrical component that implements electrical resistance as a circuit element. Resistors act to reduce current flow, and, at the same time, act to lower voltage levels within circuits. - Wikipedia; PROD_ID: RES-07828
R11 = SparkFun-Resistors:10OHM: 10Ω resistor A resistor is a passive two-terminal electrical component that implements electrical resistance as a circuit element. Resistors act to reduce current flow, and, at the same time, act to lower voltage levels within circuits. - Wikipedia; PROD_ID: RES-08705
R17 R18 = SparkFun-Resistors:300OHM: 300Ω resistor A resistor is a passive two-terminal electrical component that implements electrical resistance as a circuit element. Resistors act to reduce current flow, and, at the same time, act to lower voltage levels within circuits. - Wikipedia; PROD_ID: RES_10328
SC1 SC2 = habexpico8:KXOB22-04X3: IXYS Solar Cell
SJ1-SJ4 = SparkFun-Retired:SOLDERJUMPER: Solder Jumper Standard SMD solder jumper. Used to automate production. Two varients : Normally Open and Normally Closed are the same, but have different paste layers. NC will have a large amount of paste and should jumper during reflow.
SW1 SW2 = Seeed-Switch:SMD-BUTTON(4P-5.2X5.2X1.5MM-SKQGADE010): 311020017; MPN: SKQGADE010
TP1 TP2 = testpad:TP: Test pad
U1 = habexpico8:LTC3106: LTC Series
U2 = habexpico8:EVA-8M: u-blox EVA GNSS module
U3 = habexpico8:STM32L011G4: STM32L0 Series
U4 = habexpico8:SI4464: SI Labs
U5 = habexpico8:USB-C_R/A_HYBRID: USB-C Right Angle Hybrid Receptacle; MFG_PN: 12401548E4#2A
U6 = SparkFun-IC-Comms:FT232RL: FT232RL USB UART FT232RL 4th Generation USB UART (USB <-> Serial) Controller. Datasheet <http://www.sparkfun.com/datasheets/IC/FT232R_v104.pdf> SparkFun Products Component <https://www.sparkfun.com/products/650> (COM-00650) SparkFun RedBot Mainboard <https://www.sparkfun.com/products/12097> (ROB-12097) SparkFun FTDI Basic Breakout - 5V <https://www.sparkfun.com/products/9716> (DEV-09716) SparkFun FTDI Basic Breakout - 3.3V <https://www.sparkfun.com/products/9873> (DEV-09873) Bus Pirate - v3.6a <https://www.sparkfun.com/products/12942> (TOL-12942) SparkFun USB to Serial Breakout - FT232RL <https://www.sparkfun.com/products/12731> (BOB-12731) SparkFun PicoBoard <https://www.sparkfun.com/products/11888> (WIG-11888) SparkFun RFID USB Reader <https://www.sparkfun.com/products/9963> (SEN-09963) LilyPad FTDI Basic Breakout - 5V <https://www.sparkfun.com/products/10275> (DEV-10275) SparkFun Stepoko <https://www.sparkfun.com/products/13899> (ROB-13899); PROD_ID: IC-00870
U7 = SparkFun-IC-Power:V_REG_AP2112: AP2112 - 600mA CMOS LDO Regulator w/ Enable The AP2112 is CMOS process low dropout linear regulator with enable function, the regulator delivers a guaranteed 600mA (min.) continuous load current. Features Output Voltage Accuracy: ±1.5% Output Current: 600mA (Min.) Foldback Short Current Protection: 50mA Enable Function to Turn ON/OFF VOUT Low Dropout Voltage (3.3V): 250mV (Typ.) @IOUT=600mA Excellent Load Regulation: 0.2%/A (Typ.) Excellent Line Regulation: 0.02%/V (Typ.) Low Quiescent Current: 55μA (Typ.) Low Standby Current: 0.01μA (Typ.) Low Output Noise: 50μVRMS PSRR: 100Hz -65dB, 1kHz -65dB OTSD Protection Stable with 1.0μF Flexible Cap: Ceramic, Tantalum and Aluminum Electrolytic Operation Temperature Range: -40°C to 85°C ESD: MM 400V, HBM 4000V; PROD_ID: VREG-12457
X1-X4 X9 = con-coax:BU-SMA-V: FEMALE SMA CONNECTOR Radiall distributor RS 112-3794; OC_FARNELL: unknown; OC_NEWARK: unknown
X5 = habexpico8:JTI_ANTENNA-1575AT43A40: GPS Antenna - SMD
X6 = con-molex:C-GRID-04: CONNECTOR wire to board 2.54 mm (0.100") pitch header; MF: MOLEX; OC_FARNELL: unknown; OC_NEWARK: unknown
X7 = con-molex:C-GRID-02: CONNECTOR wire to board 2.54 mm (0.100") pitch header; MF: MOLEX; OC_FARNELL: unknown; OC_NEWARK: unknown
X8 = IQD-Frequency-Products:CRYSTALS-GND-LID: CRYSTALS WITH CAN GROUNDED
Y1 Y2 = SparkFun-Clocks:CRYSTAL-32.768KHZ: 32.768kHz Crystal Frequency: 32.768kHz Frequency Stability: ±20ppm Load Capacitance: 12.5pF (PTH-2X6 & SMD-3.2X1.5), 6pF (SMD-2X6) SparkFun Products: SparkFun BigTime Watch Kit <https://www.sparkfun.com/products/11734> SparkFun nRF52832 Breakout <https://www.sparkfun.com/products/13990> SparkFun Real Time Clock Module <https://www.sparkfun.com/products/12708>; PROD_ID: XTAL-13062

## Net classes
1 GPS_USB: width 0.406 mm, clearance 0.102 mm

## Board
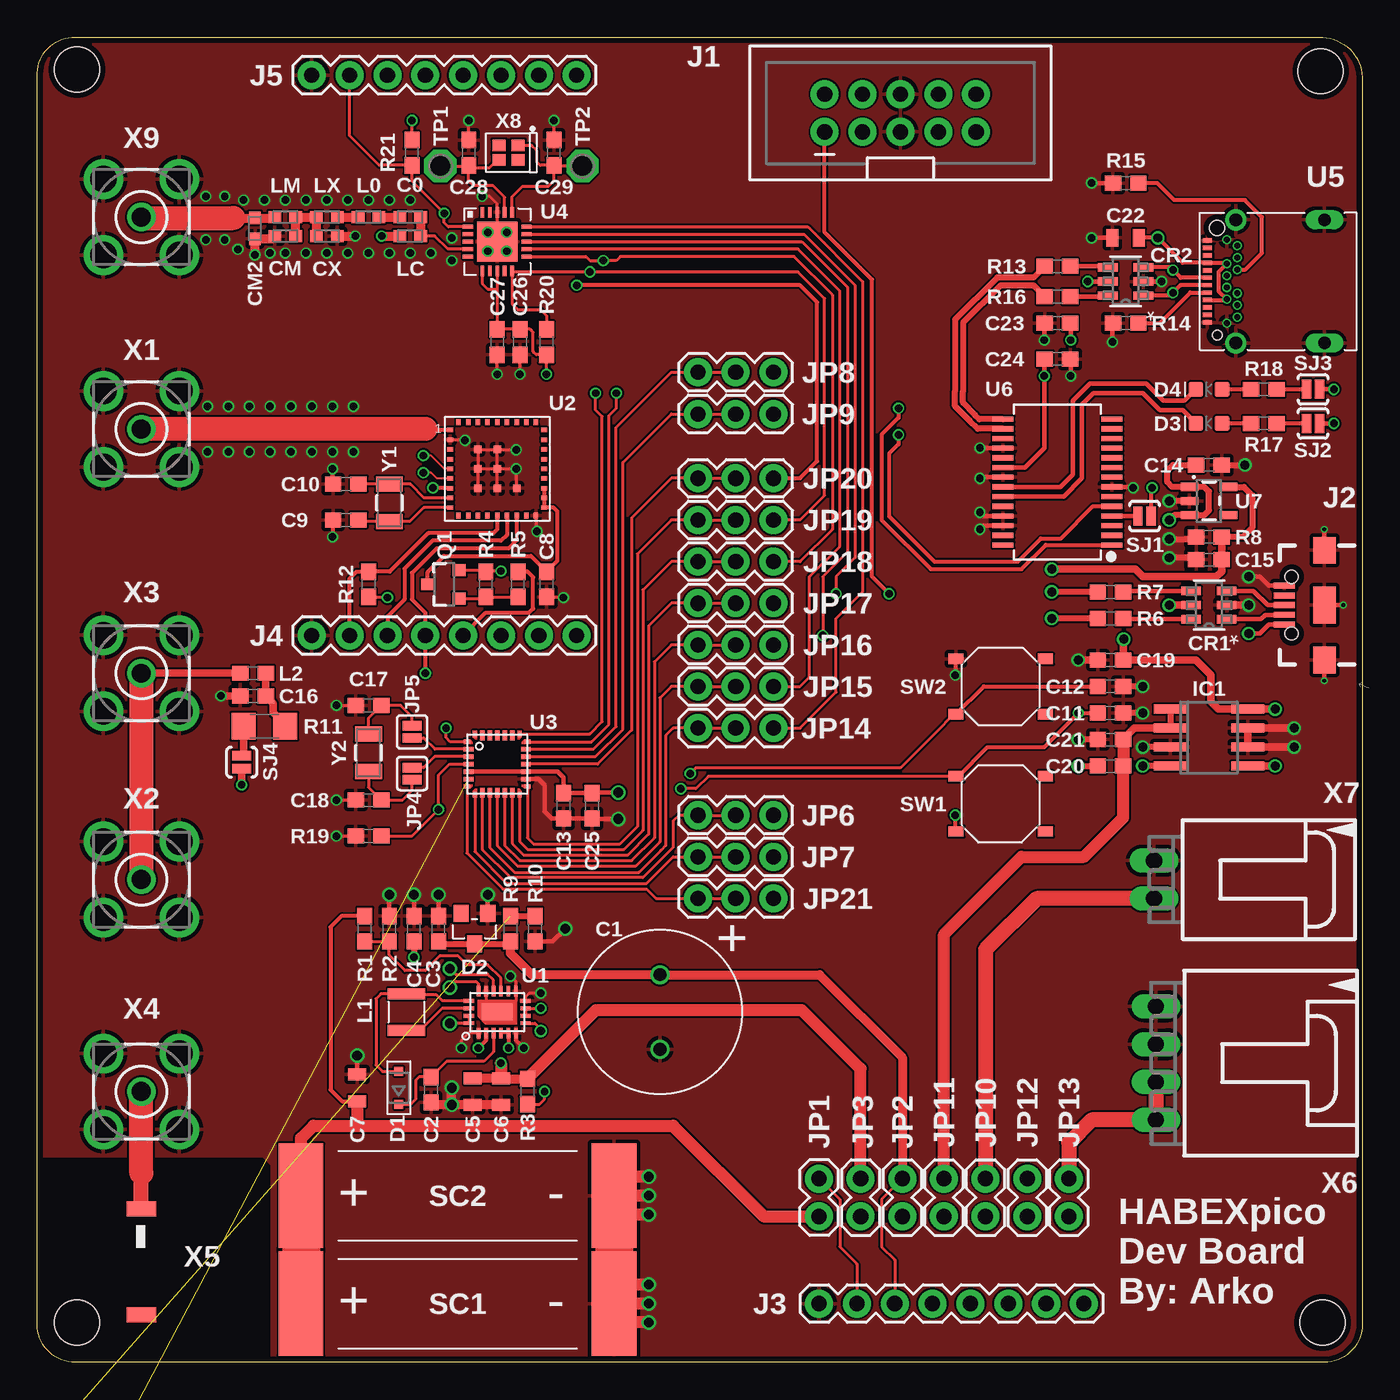
[diagram p5: board, top side]
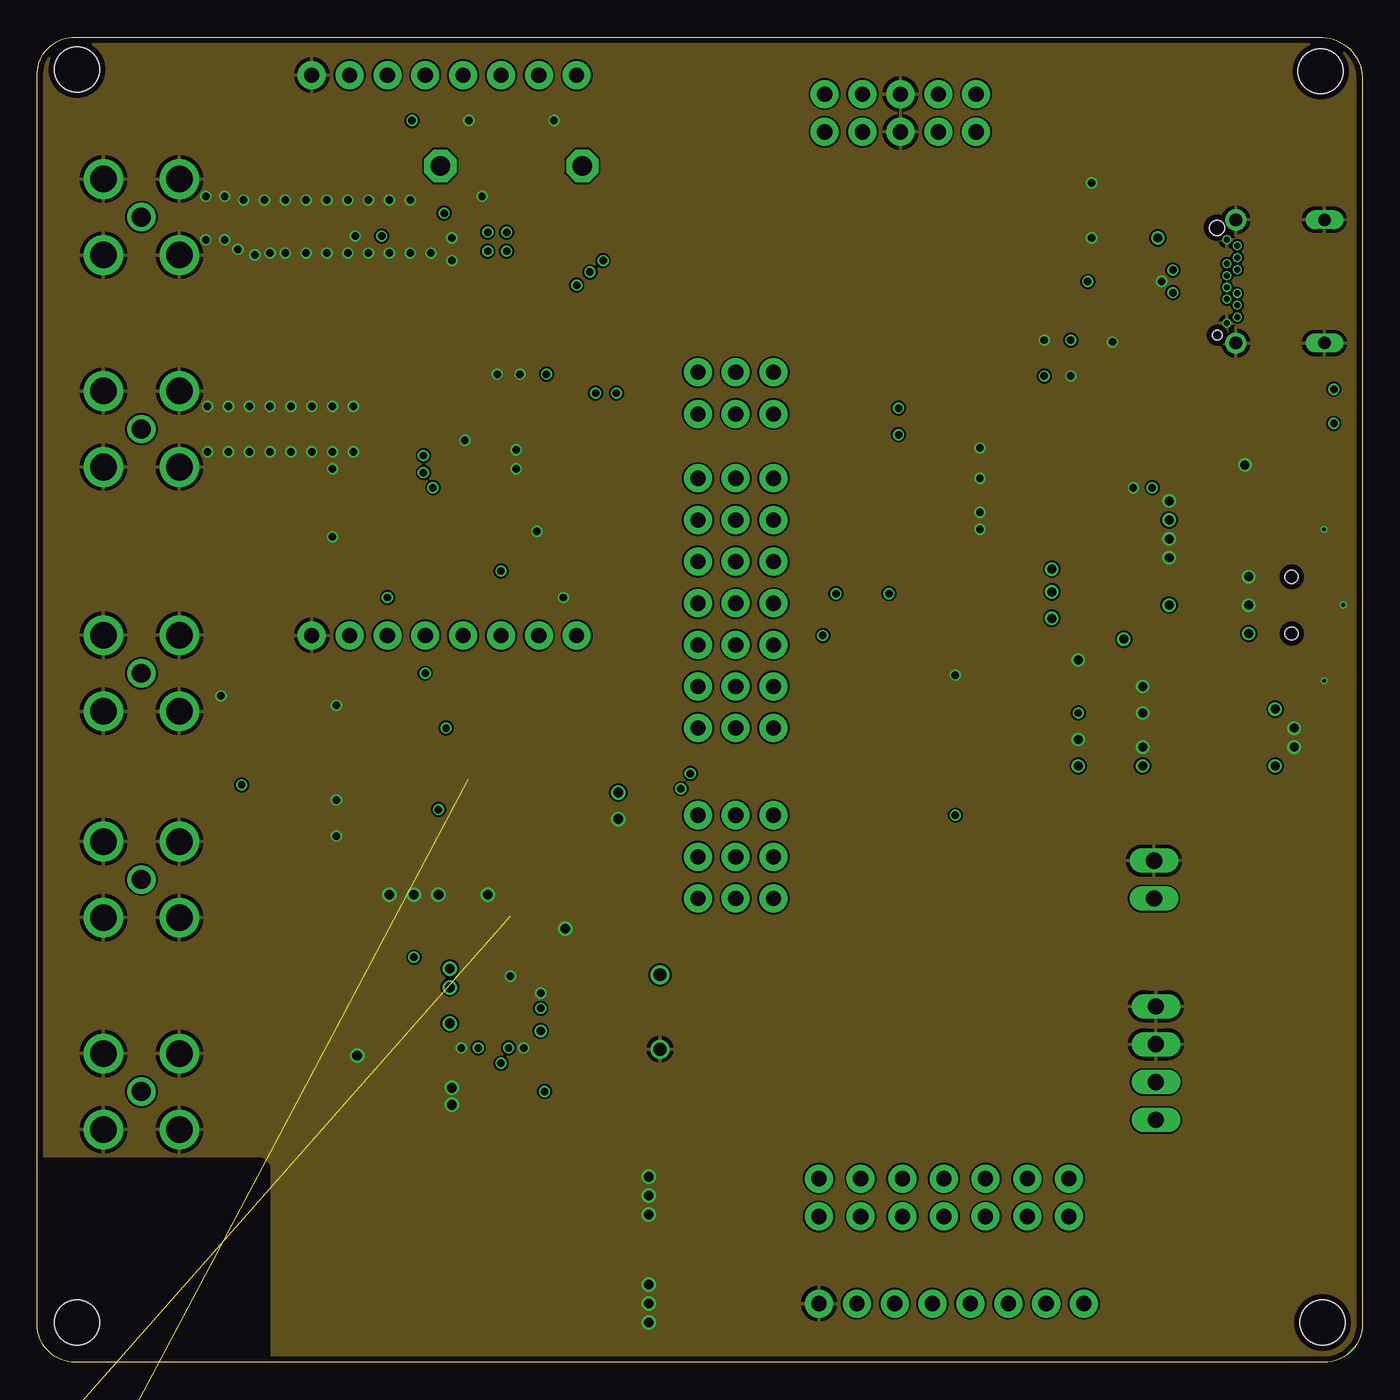
[diagram p6: board, inner layer Route2]
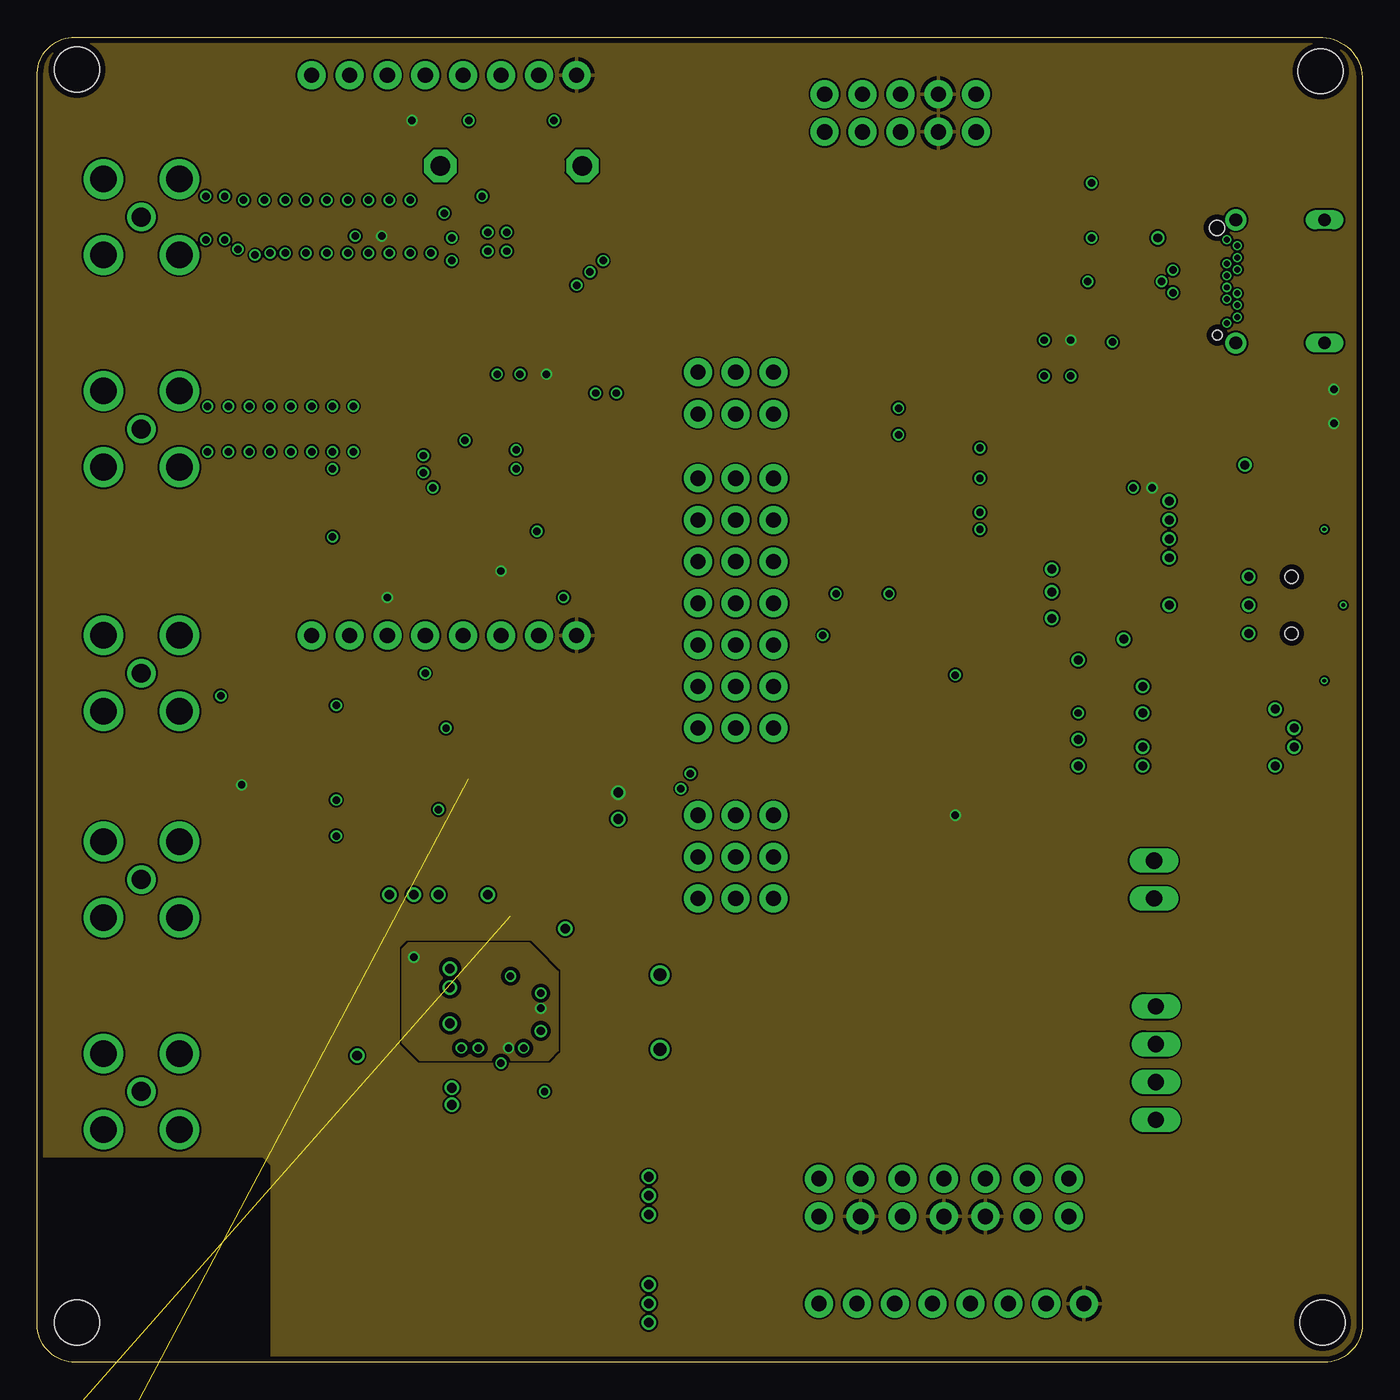
[diagram p7: board, inner layer Route15]
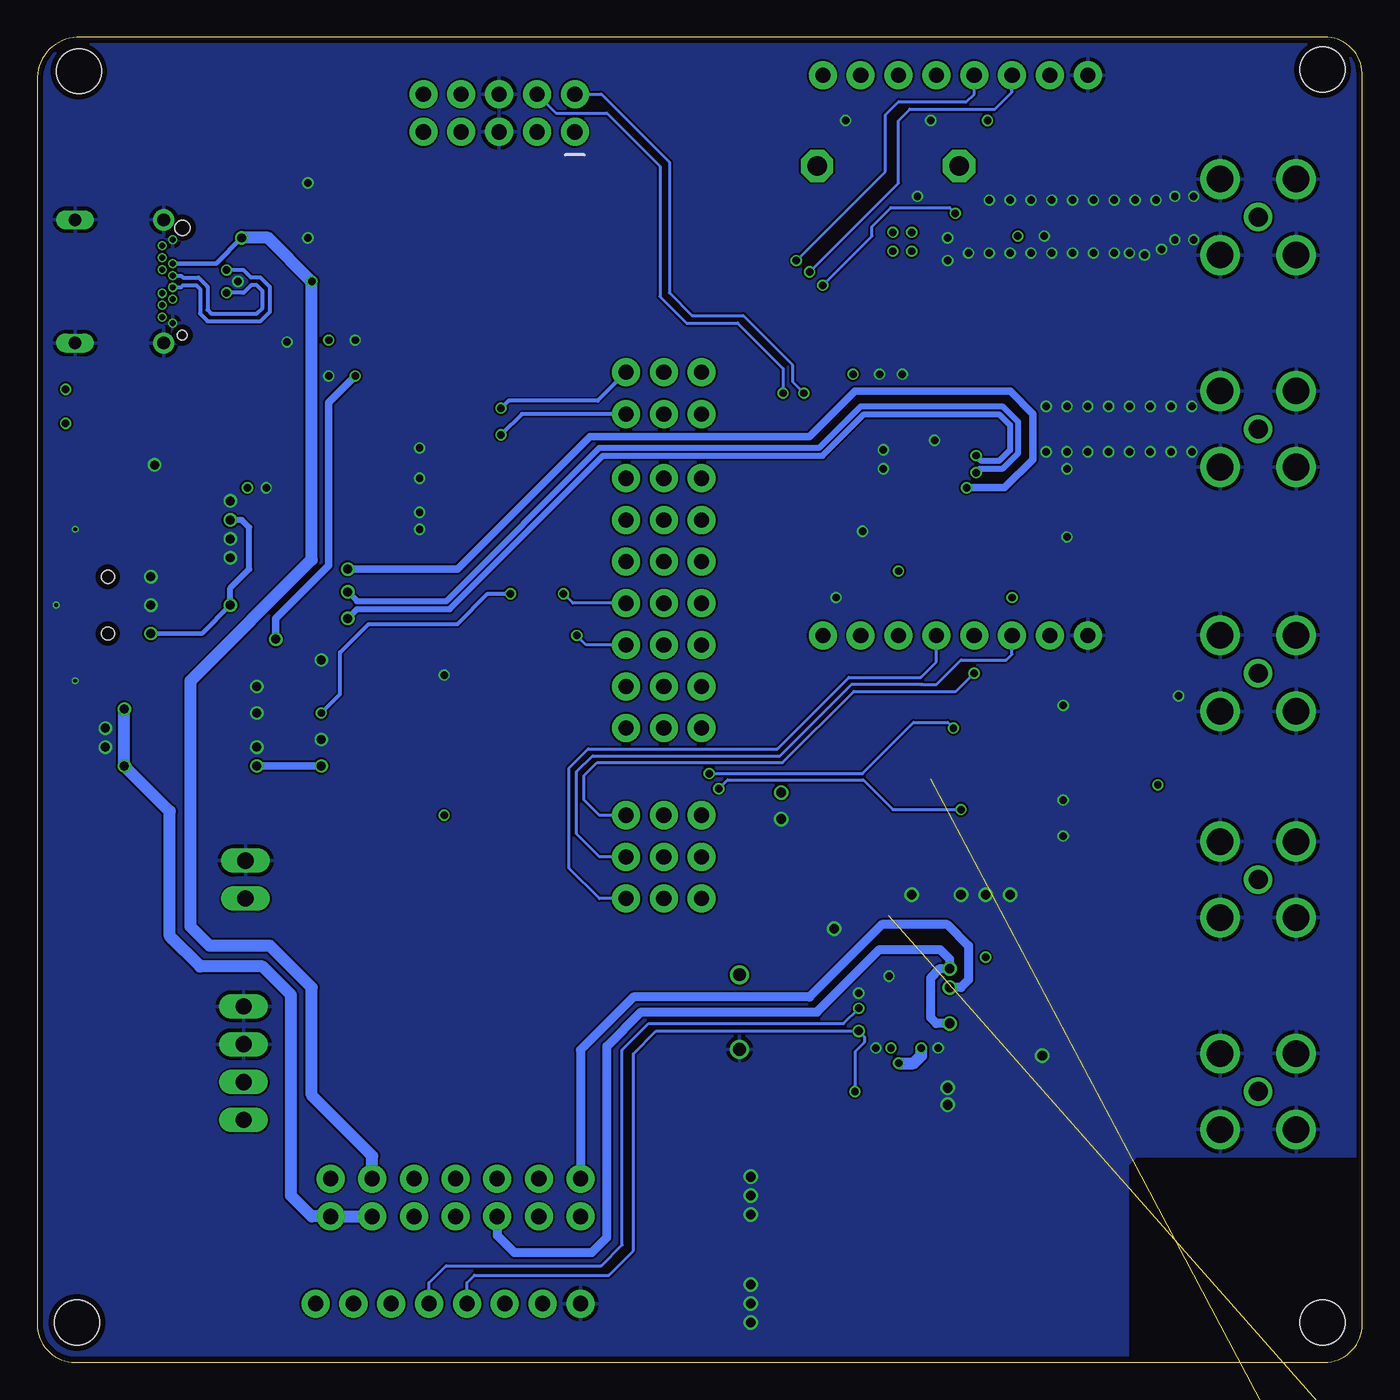
[diagram p8: board, bottom side, seen from below]

Size 88.9 x 88.9 mm. Coordinates in mm from the lower left corner, seen from the top.
Outline: 0,2.54 0,86.49 arc-90 2.54,88.9 85.98,88.9 arc-90 88.9,86.23 88.9,2.54 arc-90 86.36,0 2.54,0 arc-90 0,2.54
Copper layers (1*2*15*16): Top 0.035559375mm / dielectric 0.17018125mm / Route2 0.01778125mm / dielectric 47mil / Route15 0.01778125mm / dielectric 0.17018125mm / Bottom 0.035559375mm
Design rules "oshpark-4layer": minimum track width 5mil, minimum drill 10mil, track to track 5mil, track to pad 5mil, pad to pad 5mil, via to via 5mil, smd to smd 5mil, copper to edge 15mil, drill to drill 6mil, minimum pad ring 4mil, minimum via ring 4mil, stop-mask expansion 2.5mil, vias tented up to drill 0mil, thermal gap 10mil
Holes 3 mm at 2.67,86.74 86.11,86.61 86.23,2.67 2.67,2.67

### Footprints (pad centres in the part's own frame; a part is rotated, then mirrored left to right if it is on the bottom)
RESC0603_L = smd 0.85 x 0.8: 1 -0.7,0; 2 0.7,0
5.0MM-SUPERCAP = drill 0.85: 1 -2.5,0; 2 2.5,0
0603 = smd 1.1 x 1: 1 -0.85,0; 2 0.85,0
0805 = smd 0.8 x 1.2: 1 -0.9,0; 2 0.9,0
C0603 = smd 1.1 x 1: 1 -0.85,0; 2 0.85,0
SOT23-6L = smd 1.321 x 0.559: 1 -1.194,0.95; 2 -1.194,0; 3 -1.194,-0.95; 4 1.194,-0.95; 5 1.194,0; 6 1.194,0.95
SOD-323 = smd 0.6 x 0.6: A 1.1,0; C -1.1,0
SOT-23 = smd 1.016 x 1.143: 1 -0.889,-1.016; 2 0.889,-1.016; 3 0,1.016
LED-0603 = smd 1 x 1: A -0.877,0; C 0.877,0
SOIC8 = smd 0.6 x 2.2: 1 -1.905,-2.6; 2 -0.635,-2.6; 3 0.635,-2.6; 4 1.905,-2.6; 5 1.905,2.6; 6 0.635,2.6; 7 -0.635,2.6; 8 -1.905,2.6
2X5-SHROUDED = drill 1.016 pad 1.88: 1 -1.27,5.08; 2 1.27,5.08; 3 -1.27,2.54; 4 1.27,2.54; 5 -1.27,0; 6 1.27,0; 7 -1.27,-2.54; 8 1.27,-2.54; 9 -1.27,-5.08; 10 1.27,-5.08
USB-AB-MICRO-SMD = smd 1.4 x 0.4: D+1 2.7,0; D-1 2.7,0.65; GND1 2.7,-1.3; ID1 2.7,-0.65; VBUS1 2.7,1.3 | smd 1.5 x 1.8: SHLD1 0,-3.68; SHLD2 0,3.68 | smd 1.5 x 2.5: SHLD3 0,0 | hole 0.85: 2.2,1.9; 2.2,-1.9
1X08 = drill 1.016 pad 1.88: 1 0,0; 2 2.54,0; 3 5.08,0; 4 7.62,0; 5 10.16,0; 6 12.7,0; 7 15.24,0; 8 17.78,0
1X02 = drill 1.016 pad 1.88: 1 0,0; 2 2.54,0
SMT-JUMPER_2_NO_SILK = smd 0.635 x 1.27: 1 -0.406,0; 2 0.406,0
1X03 = drill 1.016 pad 1.88: 1 0,0; 2 2.54,0; 3 5.08,0
1210-INDUCTOR = smd 0.75 x 2.5: 1 -1.225,0; 2 1.225,0
SOT23-3 = smd 0.8 x 0.9: 1 -0.95,-1; 2 0.95,-1; 3 0,1.1
1206 = smd 1.6 x 1.8: 1 -1.4,0; 2 1.4,0
KX0B22 = smd 3 x 7: 1 -10.5,0; 2 10.5,0
SJ_2S-NO = smd 0.635 x 1.27: 1 -0.45,0; 2 0.45,0
SW4-SMD-5.2X5.2X1.5MM = smd 1 x 0.7: 1 -3,1.85; 2 3,1.85; 3 -3,-1.85; 4 3,-1.85
P1-13 = drill 1.321 pad 2.159 octagon: TP 0,0
UDC20QFN = smd 0.25 x 0.7: 1 -1.25,-1.4; 2 -0.75,-1.4; 3 -0.25,-1.4; 4 0.25,-1.4; 5 0.75,-1.4; 6 1.25,-1.4; 11 1.25,1.4; 12 0.75,1.4; 13 0.25,1.4; 14 -0.25,1.4; 15 -0.75,1.4; 16 -1.25,1.4 | smd 0.7 x 0.25: 7 1.9,-0.75; 8 1.9,-0.25; 9 1.9,0.25; 10 1.9,0.75; 17 -1.9,0.75; 18 -1.9,0.25; 19 -1.9,-0.25; 20 -1.9,-0.75 | smd 2.038 x 1.143: 21 0,0
EVA-8M = smd 0.4 x 0.3: 1 -3.15,2.6; 2 -3.15,1.95; 3 -3.15,1.3; 4 -3.15,0.65; 5 -3.15,0; 6 -3.15,-0.65; 7 -3.15,-1.3; 8 -3.15,-1.95; 9 -3.15,-2.6; 19 3.15,-2.6; 20 3.15,-1.95; 21 3.15,-1.3; 22 3.15,-0.65; 23 3.15,0; 24 3.15,0.65; 25 3.15,1.3; 26 3.15,1.95; 27 3.15,2.6 | smd 0.3 x 0.4: 10 -2.6,-3.15; 11 -1.95,-3.15; 12 -1.3,-3.15; 13 -0.65,-3.15; 14 0,-3.15; 15 0.65,-3.15; 16 1.3,-3.15; 17 1.95,-3.15; 18 2.6,-3.15; 28 2.6,3.15; 29 1.95,3.15; 30 1.3,3.15; 31 0.65,3.15; 32 0,3.15; 33 -0.65,3.15; 34 -1.3,3.15; 35 -1.95,3.15; 36 -2.6,3.15 | smd 0.5 x 0.5: 37 -1.3,1.3; 38 0,1.3; 39 -1.3,0; 40 0,0; 41 -1.3,-1.3; 42 0,-1.3; 43 1.3,-1.3
UFQFPN28 = smd 0.4 x 0.3: 1 -2.025,1.5; 7 -2.025,-1.5; 15 2.025,-1.5; 21 2.025,1.5 | smd 0.65 x 0.3: 2 -1.925,1; 3 -1.925,0.5; 4 -1.925,0; 5 -1.925,-0.5; 6 -1.925,-1; 16 1.925,-1; 17 1.925,-0.5; 18 1.925,0; 19 1.925,0.5; 20 1.925,1 | smd 0.3 x 0.4: 8 -1.5,-2.025; 14 1.5,-2.025; 22 1.5,2.025; 28 -1.5,2.025 | smd 0.3 x 0.65: 9 -1,-1.925; 10 -0.5,-1.925; 11 0,-1.925; 12 0.5,-1.925; 13 1,-1.925; 23 1,1.925; 24 0.5,1.925; 25 0,1.925; 26 -0.5,1.925; 27 -1,1.925
QFN20+GNDPAD = smd 0.7 x 0.25: 1 -1.97,1; 2 -1.97,0.5; 3 -1.97,0; 4 -1.97,-0.5; 5 -1.97,-1; 11 1.97,-1; 12 1.97,-0.5; 13 1.97,0; 14 1.97,0.5; 15 1.97,1 | smd 0.25 x 0.7: 6 -1,-1.97; 7 -0.5,-1.97; 8 0,-1.97; 9 0.5,-1.97; 10 1,-1.97; 16 1,1.97; 17 0.5,1.97; 18 0,1.97; 19 -0.5,1.97; 20 -1,1.97 | smd 2.7 x 2.7: 21 0,0
USB-C_R/A_HYBRID_RCPT = smd 0.3 x 0.7: A1 -2.75,2.01; A2 -2.25,2.01; A3 -1.75,2.01; A4 -1.25,2.01; A5 -0.75,2.01; A6 -0.25,2.01; A7 0.25,2.01; A8 0.75,2.01; A9 1.25,2.01; A10 1.75,2.01; A11 2.25,2.01; A12 2.75,2.01 | drill 0.4 pad 0.61: B1 2.8,0.7; B2 2.4,0; B3 1.6,0; B4 1.2,0.7; B5 0.8,0; B6 0.4,0.7; B7 -0.4,0.7; B8 -0.8,0; B9 -1.2,0.7; B10 -1.6,0; B11 -2.4,0; B12 -2.8,0.7 | drill 0.85 pad 1.422: SHL1 -4.13,0.1; SHL4 4.13,0.1 | drill 0.85 pad 1.27 long: SHL2 -4.13,-5.85; SHL3 4.13,-5.85 | hole 0.65: -3.6,1.35 | hole 1: 3.6,1.35
SSOP28DB = smd 0.348 x 1.397: 1 -4.225,-3.656; 2 -3.575,-3.656; 3 -2.925,-3.656; 4 -2.275,-3.656; 5 -1.625,-3.656; 6 -0.975,-3.656; 7 -0.325,-3.656; 8 0.325,-3.656; 9 0.975,-3.656; 10 1.625,-3.656; 11 2.275,-3.656; 12 2.925,-3.656; 13 3.575,-3.656; 14 4.225,-3.656; 15 4.225,3.656; 16 3.575,3.656; 17 2.925,3.656; 18 2.275,3.656; 19 1.625,3.656; 20 0.975,3.656; 21 0.325,3.656; 22 -0.325,3.656; 23 -0.975,3.656; 24 -1.625,3.656; 25 -2.275,3.656; 26 -2.925,3.656; 27 -3.575,3.656; 28 -4.225,3.656
SOT23-5 = smd 0.55 x 1.2: 1 -0.95,-1.3; 2 0,-1.3; 3 0.95,-1.3; 4 0.95,1.3; 5 -0.95,1.3
BU-SMA-V = drill 1.27: 1 0,0 | drill 1.778: 2 -2.55,2.55; 3 2.55,2.55; 4 2.55,-2.55; 5 -2.55,-2.55
JTI_ANTENNA-1575AT43A40 = smd 1 x 2: FEED -3.175,0; NC 3.925,0
70553-04 = drill 1.092 long: 1 -3.81,-7.62; 2 -1.27,-7.62; 3 1.27,-7.62; 4 3.81,-7.62
70553-02 = drill 1.092 long: 1 -1.27,-7.62; 2 1.27,-7.62
2.0X1.6-4-PAD = smd 0.875 x 0.775: 1 -0.637,-0.487; 2 0.637,-0.487; 3 0.637,0.487; 4 -0.637,0.487
CRYSTAL-SMD-3.2X1.5MM = smd 1 x 1.8: P$1 -1.25,0; P$2 1.25,0

### Placement (x,y rotation side)
C0  25.02,76.83 180 top
C1  41.78,23.5 270 top
C2  26.42,18.29 270 top
C3  26.92,29.08 90 top
C4  25.27,29.08 90 top
C5  29.21,18.16 270 top
C6  31.11,18.16 270 top
C7  21.46,18.41 90 top
C8  34.16,52.2 270 top
C9  20.7,56.52 180 top
C10  20.7,58.93 180 top
C11  72.01,43.56 0 top
C12  72.01,45.34 0 top
C13  35.31,37.34 270 top
C14  78.61,60.2 0 top
C15  78.61,53.85 180 top
C16  14.48,44.7 180 top
C17  22.23,44.07 180 top
C18  22.23,37.72 180 top
C19  72.01,47.12 180 top
C20  72.01,40.01 180 top
C21  72.01,41.78 180 top
C22  73.03,75.44 180 top
C23  68.45,69.72 180 top
C24  68.45,67.31 0 top
C25  37.21,37.34 270 top
C26  32.38,68.45 270 top
C27  30.86,68.45 270 top
C28  28.96,81.15 90 top
C29  34.67,81.15 90 top
CM  16.64,75.56 180 top
CM2  14.61,76.07 270 top
CR1  78.61,50.8 180 top
CR2  73.03,72.52 180 top
CX  19.43,75.56 0 top
D1  24.26,18.41 90 top
D2  29.34,29.08 180 top
D3  78.61,62.99 180 top
D4  78.61,65.28 180 top
IC1  78.61,41.91 270 top
J1  57.91,83.82 90 top
J2  86.36,50.8 180 top
J3  52.45,3.94 0 top
J4  18.41,48.77 0 top
J5  18.41,86.36 0 top
JP1  52.45,12.32 270 top
JP2  58.04,9.78 90 top
JP3  55.24,9.78 90 top
JP4  25.15,39.5 270 top
JP5  25.15,42.29 90 top
JP6  49.4,36.7 180 top
JP7  49.4,33.91 180 top
JP8  49.4,66.42 180 top
JP9  49.4,63.63 180 top
JP10  63.63,9.78 90 top
JP11  60.83,9.78 90 top
JP12  66.42,9.78 90 top
JP13  69.22,9.78 90 top
JP14  49.4,42.55 180 top
JP15  49.4,45.34 180 top
JP16  49.4,48.13 180 top
JP17  49.4,50.93 180 top
JP18  49.4,53.72 180 top
JP19  49.4,56.52 180 top
JP20  49.4,59.31 180 top
JP21  49.4,31.11 180 top
JP22  -0.25,-6.35 0 top  (outside the outline)
L0  22.23,76.83 0 top
L1  24.77,23.5 270 top
L2  14.48,46.23 180 top
LC  25.02,75.56 0 top
LM  16.64,76.83 0 top
LX  19.43,76.83 0 top
Q1  27.3,52.2 90 top
R1  21.97,29.08 90 top
R2  23.62,29.08 270 top
R3  32.89,18.16 270 top
R4  30.1,52.2 90 top
R5  32.26,52.2 90 top
R6  72.01,49.91 180 top
R7  72.01,51.69 180 top
R8  78.61,55.37 0 top
R9  31.75,29.08 270 top
R10  33.4,29.08 90 top
R11  15.24,42.67 180 top
R12  22.23,52.2 270 top
R13  68.45,73.53 180 top
R14  73.03,69.72 180 top
R15  73.03,79.12 180 top
R16  68.45,71.5 180 top
R17  82.3,62.99 0 top
R18  82.3,65.28 0 top
R19  22.23,35.31 0 top
R20  34.16,68.45 270 top
R21  25.15,81.15 90 top
SC1  28.19,3.94 0 top
SC2  28.19,11.18 0 top
SJ1  74.3,56.77 180 top
SJ2  85.6,62.99 0 top
SJ3  85.6,65.28 0 top
SJ4  13.72,40.26 270 top
SW1  64.64,37.47 180 top
SW2  64.64,45.34 180 top
TP1  27.05,80.26 0 top
TP2  36.58,80.26 0 top
U1  30.86,23.5 0 top
U2  30.86,59.94 0 top
U3  30.86,40.13 0 top
U4  30.86,75.18 0 top
U5  80.52,72.52 90 top
U6  68.45,59.05 90 top
U7  78.61,57.78 270 top
X1  6.99,62.61 0 top
X2  6.99,32.38 0 top
X3  6.99,46.23 0 top
X4  6.99,18.16 0 top
X5  6.99,7.11 270 top
X6  82.68,20.07 270 top
X7  82.55,32.38 270 top
X8  31.62,81.15 180 top
X9  6.99,76.83 0 top
Y1  23.62,57.66 90 top
Y2  22.23,40.89 270 top

### Tracks (layer width: path | path; a pad name or v marks a point on that pad's centre or on a via)
3.3V  (via drill 0.5, 0.65)
  Top 0.203: Q1.2 30,53.15 R4.2 30.14,53.09 v31.11,53.09 | U4.6 29.86,72.37 30.23,72.01 30.86,72.01 | 30.86,72.01 C27.1 C26.1 33.06,69.3 33.27,69.09 33.27,67.82 33.49,67.6 R20.2 v34.16,66.29 | U4.8 30.86,72.01 | R12.2 23.46,51.35 v23.5,51.31 | R21.2 v25.15,83.31
  Top 0.254: SW1.2 61.59,35.66 v61.59,36.7 | SJ1.1 74.75,58.62 v74.8,58.67
  Top 0.305: v38.99,38.23 37.25,38.23 C25.1 C13.1 35.31,39.24 34.92,39.63 U3.17 U3.5 | v87,62.99 SJ2.2 | v87,65.28 SJ3.2 | v69.34,68.58 69.34,69.68 C23.1
  Top 0.508: v13.72,38.73 SJ4.2
  Top 0.61: v23.11,75.56 LC.1
  pour Route15 (rank 2): -0.38,-0.25 -0.38,89.53 -0.38,89.66 -0.38,89.79 88.65,89.79 89.28,89.79 89.28,-0.25 89.28,-0.38 -0.38,-0.38
5V  (via drill 0.5, 0.6)
  Top 0.305: C24.1 67.56,67.27 v67.56,66.17 67.56,61.34 66.25,60.03 U6.20
  Top 0.508: v83.06,43.81 IC1.8 79.25,43.81 78.74,44.32 78.74,46.1 77.72,47.12 C19.1 72.86,48.48 v72.9,48.51 | IC1.5 v83.06,40.01
  Bottom 0.508: v67.56,66.17 69.34,64.39 69.34,53.47 72.9,49.91 v72.9,48.51
  Bottom 0.813: JP12.1 JP13.1 70.48,9.78 71.88,11.18 71.88,24.64 73.79,26.54 77.98,26.54 80.01,28.57 80.01,36.96 v83.06,40.01 v83.06,43.81
ADC_VSTORAGE  (1 unrouted)
  Top 0.406: R9.1 R10.2
ANT_OUT
  Top 0.61: 13.15,76.77 CM2.1 15.88,76.77 LM.1
  Top 1.626: 13.15,76.77 7.05,76.77 X9.1
FTDI_SER_RXD  (via drill 0.5)
  Top 0.254: v57.78,62.23 57.78,61.59 57.15,60.96 57.15,56.77 60.2,53.72 65.79,53.72 67.34,55.27 68.68,55.27 70.84,57.43 U6.5
  Bottom 0.254: JP9.1 56.39,63.63 v57.78,62.23
FTDI_SER_TXD  (via drill 0.5)
  Top 0.254: U6.1 67.66,54.83 66.04,53.21 59.94,53.21 56.64,56.52 56.64,62.23 57.78,63.37 v57.78,64.01
  Bottom 0.254: v57.78,64.01 57.28,64.52 51.31,64.52 JP8.1
GND  (via drill 0.25, 0.5, 0.6, 0.65)
  Top 0.203: U4.21 U4.18 30.86,77.72 30.35,78.23 v29.84,78.23 | U1.1 28.95,22.09 28.45,21.59 v28.45,21.08 | U1.15 30.1,23.62 30.23,23.5 U1.21 31.37,23.5 32.11,24.24 U1.11 32.11,25.55 v31.75,25.91 | v33.78,24.77 33.03,24.77 32.76,24.5 U1.10 | v20.07,44.07 C17.2 | v20.07,37.72 C18.2 | v20.07,35.31 R19.1 | C8.2 35.27,51.35 v35.31,51.31 | U2.38 U2.37 U2.39 29.59,59.94 | 29.59,59.94 U2.40 | U2.40 v32.13,59.94 32.16,59.91 U2.43 | U2.38 32.1,61.24 v32.13,61.21 | U2.41 29.56,59.91 29.59,59.94 | U2.42 U2.40 | U2.40 U2.38 | U2.18 33.46,55.82 v33.53,55.75 | U2.2 28.66,61.89 v28.7,61.85 | v30.86,66.29 C27.2 | v32.38,66.29 C26.2 | C28.2 v28.96,83.31 | C29.2 v34.67,83.31
  Top 0.254: SW2.4 61.59,47.14 v61.59,46.1 | U1.6 32.11,21.61 v32.64,21.08 | C10.2 19.81,58.97 v19.81,59.94 | C9.2 19.81,56.48 v19.81,55.37
  Top 0.305: U3.16 33.64,39.13 34.04,38.73 34.04,36.96 34.51,36.49 C13.2 C25.2 37.25,36.45 v38.99,36.45 | R2.1 v23.62,31.37 | C4.2 v25.27,31.37 | C3.2 v26.92,31.37 | D2.1 v30.23,31.37 | R10.1 34.58,28.23 v35.43,29.08 | v21.46,20.57 C7.2 | J2.GND1 82.65,52.1 82.04,52.7 v81.28,52.7 | CR2.2 v75.44,72.52 | v67.56,68.58 67.56,69.68 C23.2 | v72.14,68.45 72.14,69.68 R14.2 | R15.2 v70.74,79.12 | C22.2 v70.74,75.44 | U6.25 63.49,56.78 v63.25,57.02 | U6.26 63.5,56.13 v63.25,55.88 | U6.21 63.32,59.38 v63.25,59.31 | U6.18 v63.26,61.33 v63.25,61.34 | U6.7 73.48,58.73 v73.53,58.67 | J2.SHLD1 v86.36,55.88 | J2.SHLD3 v87.63,50.8 | J2.SHLD2 v86.36,45.72 | C24.2 69.34,67.27 v69.34,66.17
  Top 0.406: IC1.3 v74.17,41.27 | v74.17,43.56 C11.2 | v74.17,45.34 C12.2 | C21.2 v69.85,41.78 | U7.2 v75.95,57.78 | v75.95,55.24 77.64,55.24 R8.1 | v75.95,53.98 77.64,53.98 C15.2 | C14.2 v81.03,60.2
  Top 0.508: v84.33,42.55 IC1.7 IC1.6 v84.33,41.27 | CR1.2 v81.28,50.8 | v69.85,47.12 C19.2 | v12.32,44.7 C16.2
  Top 0.61: v27.81,17.27 27.82,17.26 C5.2 C6.2 | v27.81,17.27 26.58,17.27 C2.2 | v27.81,17.27 v27.81,18.41 | CM.2 15.74,75.37 CM2.2 v14.61,74.3 | CX.2 v21.34,75.56
  Top 0.813: v41.02,11.18 SC2.2 | v41.02,12.45 39.96,12.45 SC2.2 | v41.02,9.91 39.96,9.91 SC2.2 | v41.02,3.94 SC1.2 | v41.02,5.21 39.96,5.21 SC1.2 | v41.02,2.67 39.96,2.67 SC1.2
  Top 2.54: SC2.2 SC1.2
  other vias: 27.81,75.44 27.81,73.91 26.42,74.42 25.02,74.42 23.62,74.42 22.23,74.42 25.02,77.98 23.62,77.98 22.23,77.98 20.83,74.42 19.43,74.42 18.03,74.42 16.64,74.42 20.83,77.98 19.43,77.98 18.03,77.98 16.64,77.98 15.24,77.98 13.84,77.98 12.57,78.23 11.3,78.23 12.57,75.31 11.3,75.31 13.46,74.68 15.62,74.42 11.43,64.14 12.83,64.14 14.22,64.14 15.62,64.14 17.02,64.14 18.41,64.14 19.81,64.14 21.21,64.14 11.43,61.09 12.83,61.09 14.22,61.09 15.62,61.09 17.02,61.09 18.41,61.09 19.81,61.09 21.21,61.09
  pour Route2: -0.25,-0.25 89.15,-0.25 89.15,89.66 -0.25,89.66
  pour Top: -0.25,-0.51 89.15,-0.51 89.15,89.41 -0.25,89.41
  pour Bottom: -0.25,-0.51 89.15,-0.51 89.15,89.41 -0.25,89.41
GNDKEEPOUT
  cutout Route2: 0.51,13.72 15.11,13.72 15.62,13.21 15.62,0 0,0 0,13.72
  cutout Route15: 0,13.72 15.11,13.72 15.62,13.21 15.62,0 0,0
  cutout Top: 0.51,13.72 15.11,13.72 15.62,13.21 15.62,0 0,0 0,13.72
  cutout Bottom: 0.51,13.72 15.11,13.72 15.62,13.21 15.62,0 0,0 0,13.72
GPS_EN
  Top 0.254: J4.5 30.1,50.29 32.99,50.29 33.27,50.56 33.27,52.67 32.89,53.05 R5.2
  Bottom 0.203: JP21.1 51.18,31.11 53.21,33.15 53.21,39.88 51.94,41.15 39.24,41.15 34.44,45.95 29.61,45.95 28.57,46.99 J4.5
GPS_RESET
  Top 0.254: U2.14 30.86,55.88 30.61,55.63 26.23,55.63 23.65,53.05 R12.1 21.42,53.05 20.95,52.58 J4.2
GPS_RX
  Top 0.254: U2.15 31.51,55.51 31.11,55.12 26.51,55.12 24.64,53.24 24.64,51.18 23.5,50.04 J4.3
  Bottom 0.203: JP7.1 51.18,33.91 52.7,35.43 52.7,39.62 51.64,40.69 39.06,40.69 34.29,45.47 29.59,45.47 29.46,45.47 28.57,45.47 26.92,47.12 23.88,47.12 23.5,47.5 J4.3
GPS_TX  (via drill 0.5)
  Top 0.254: U2.16 32.16,55.15 31.62,54.61 26.8,54.61 25.15,52.96 25.15,51.18 26.04,50.29 J4.4 v26.04,46.23
  Bottom 0.203: JP6.1 51.18,36.7 52.2,37.72 52.2,39.37 51.34,40.23 38.89,40.23 34.11,45.01 27.25,45.01 v26.04,46.23
GPS_USB_N  (via drill 0.5, 0.6)
  Top 0.127: U2.5 27.3,59.94 26.42,60.83 v25.91,60.83
  Top 0.406: R6.2 v68.07,49.91
  Bottom 0.406: v68.07,49.91 67.45,50.53 65.79,50.53 61.23,50.53 50.94,60.82 36.21,60.82 33.42,63.61 25.65,63.61 | 25.65,63.61 | 25.65,63.61 24.37,63.61 23.64,62.88 23.64,61.59 23.64,61.2 24.07,60.77 24.37,60.47 24.77,60.47 25.54,60.47 v25.91,60.83
GPS_USB_P  (via drill 0.5, 0.6)
  Top 0.127: U2.6 26.81,59.29 26.42,59.69 v25.91,59.69
  Top 0.406: R7.2 v68.07,51.69
  Bottom 0.406: v68.07,51.69 67.45,51.07 65.79,51.07 61.45,51.07 51.16,61.35 36.43,61.35 33.64,64.15 25.65,64.15 24.15,64.15 23.1,63.1 23.1,61.59 23.1,60.98 23.69,60.39 24.15,59.93 25.67,59.93 v25.91,59.69
GPS_USB_VDD  (via drill 0.5, 0.6)
  Top 0.254: U2.7 26.57,58.64 v26.54,58.67
  Top 0.406: U7.5 80.97,58.73 81.53,58.17 81.53,56.01 80.9,55.37 R8.2
  Top 0.508: R8.2 C15.1 79.46,53.05 79.12,52.7 74.17,52.7 73.66,53.21 v68.07,53.21
  Bottom 0.508: v68.07,53.21 60.71,53.21 51.82,62.1 37.08,62.1 34.04,65.15 23.62,65.15 22.1,63.63 22.1,60.58 24,58.67 v26.54,58.67
GPS_VCC
  Top 0.254: U2.21 U2.20 U2.19 34.65,57.34 34.9,57.09 34.9,53.78 C8.1 33.12,54.1 27.29,54.1 26.2,53.02 Q1.3
LPUART1_RX
  Top 0.203: U3.9 29.86,34.4 31.75,32.51 40.64,32.51 42.67,34.54 42.67,36.32 43.05,36.7 JP6.3 JP6.2
LPUART1_TX
  Top 0.203: U3.8 29.36,34.27 31.5,32.13 40.89,32.13 42.67,33.91 JP7.3 JP7.2
MCU_ADC_VSTORAGE  (2 unrouted)
MCU_BOOT0  (via drill 0.5)
  Top 0.203: SW2.2 61.52,43.49 60.25,42.22 57.91,39.88 44.2,39.88 v43.81,39.5 | v27.43,42.55 27.43,41.91 27.71,41.63 U3.1
  Top 0.254: SW2.2 63.5,45.34 C12.1
  Bottom 0.203: v43.81,39.5 33.53,39.5 30.1,42.93 27.81,42.93 v27.43,42.55
MCU_GPS_EN
  Top 0.203: U3.7 28.84,34.16 31.24,31.75 40.89,31.75 41.53,31.11 JP21.3 JP21.2
MCU_OSC32_IN
  Top 0.203: U3.2 26.69,41.13 25.93,41.88 JP5.1
MCU_OSC32_OUT
  Top 0.203: U3.3 26.66,40.63 25.93,39.9 JP4.1
MCU_RADIO_EN
  Top 0.203: U3.18 37.59,40.13 39.88,42.42 39.88,56.64 42.55,59.31 JP20.3 JP20.2
MCU_RADIO_GPIO1
  Top 0.203: U3.15 32.89,35.19 33.33,34.75 39.06,34.75 40.26,35.94 40.26,54.23 42.55,56.52 JP19.3 JP19.2
MCU_RADIO_NIRQ
  Top 0.203: U3.14 32.36,34.95 32.89,34.42 39.37,34.42 40.64,35.69 40.64,51.82 42.55,53.72 JP18.3 JP18.2
MCU_RESET  (via drill 0.5)
  Top 0.203: U3.4 27.67,40.13 26.92,39.39 v26.92,37.08 25.15,35.31 R19.2 | SW1.4 45.03,39.31 44.2,38.48 v43.18,38.48
  Top 0.254: C11.1 v69.85,43.56 67.56,41.27 63.75,41.27 61.79,39.31 SW1.4 | J1.1 52.83,75.82 56.01,72.64 56.01,52.7 v57.15,51.56
  Bottom 0.203: v43.18,38.48 42.59,39.07 33.48,39.07 31.5,37.08 v26.92,37.08
  Bottom 0.254: v57.15,51.56 58.67,51.56 60.71,49.53 66.67,49.53 68.58,47.62 68.58,44.83 v69.85,43.56
N$1
  Top 0.203: U1.17 27.19,24.25 26.8,24.64 24.85,24.64 L1.1 23.07,24.72 22.73,24.38 22.73,19.94 23.16,19.52 D1.A
N$2
  Top 0.203: U1.18 27.17,23.75 25.7,22.27 L1.2
N$3
  Top 0.203: D1.C 25.06,17.32 25.4,17.65 25.4,18.92 25.61,19.14 C2.1 27.47,20.19 29.97,20.19 30.61,20.83 U1.3
N$4
  Top 1.016: X5.FEED 6.99,12.7
  Top 1.626: 6.99,12.7 X4.1
N$5
  Top 0.203: Q1.1 30,51.25 R4.1 R5.1
N$6
  Top 0.203: C9.1 21.66,56.41 Y1.P$1 25,56.41 25.93,57.34 U2.9
N$7
  Top 0.203: U2.8 25.95,57.99 25.04,58.91 Y1.P$2 21.57,58.91 C10.1
N$8
  Top 0.305: CR1.6 72.92,49.85 R6.1
N$9
  Top 0.305: CR1.4 72.92,51.75 R7.1
N$10
  Top 0.203: JP5.2 25.15,43.31 24.38,44.07 C17.1 22.23,43.22 Y2.P$1
N$11  (via drill 0.65)
  Top 0.203: U1.14 30.61,25.65 30.23,26.04 28.07,26.04 v27.69,26.42 | U1.19 U1.20 28.95,22.73 v27.69,22.73
  Bottom 0.61: JP2.1 58.04,8.51 56.9,7.37 51.69,7.37 50.67,8.38 50.67,21.21 48.39,23.5 36.58,23.5 32.38,27.69 28.32,27.69 27.69,27.05 v27.69,26.42 28.32,26.42 28.96,25.78 28.96,23.11 28.57,22.73 v27.69,22.73
N$12
  Top 0.508: L2.1 C16.1 15.84,44.2 15.84,43.6 16.64,42.8 R11.1
N$13
  Top 0.203: Y2.P$2 22.23,38.57 C18.1 24.51,37.72 25.15,38.35 JP4.2
N$14
  Top 0.508: X3.1 L2.2
  Top 1.626: X3.1 X2.1
N$15
  Top 0.305: CR2.6 71.77,71.5 R16.1
N$16
  Top 0.305: CR2.4 71.77,73.53 R13.1
N$17
  Top 0.305: U6.23 68.88,58.08 70.1,59.31 70.1,64.26 70.87,65.02 74.17,65.02 75.31,63.88 76.85,63.88 D3.C
N$18
  Top 0.305: U6.22 68.64,58.73 69.47,59.56 69.47,64.52 70.61,65.66 74.42,65.66 75.56,64.52 76.97,64.52 D4.C
N$19  (via drill 0.6)
  Top 0.406: IC1.4 v74.17,40.01 | v69.85,40.01 C20.2
  Bottom 0.508: v74.17,40.01 v69.85,40.01
N$20
  Top 0.254: R17.1 D3.A
N$21
  Top 0.254: D4.A R18.1
N$22
  Top 0.305: U6.4 72.12,56.77 SJ1.2
N$23
  Top 0.254: SJ2.1 R17.2
N$24
  Top 0.254: R18.2 SJ3.1
N$25
  Top 0.508: SJ4.1 13.84,40.83 R11.2
N$26
  Top 0.203: C28.1 28.96,79.25 29.27,78.93 30.6,78.93 31.36,78.17 U4.17 | C28.1 29.1,80.16 30.35,80.16 30.86,80.67 | TP1.TP 28.92,80.26 C28.1
  Top 0.254: X8.3 30.86,80.67
N$27
  Top 0.203: U4.16 31.86,78.22 32.55,78.91 34.29,78.91 34.67,79.29 C29.1 | C29.1 33.74,80.3 33.53,80.52 33.53,81.28 33.17,81.64 X8.1 | TP2.TP 34.71,80.26 C29.1
N$28
  Top 0.203: U4.4 27.55,74.68 26.67,75.56 LC.2
  Top 0.61: C0.1 LC.2
N$29
  Top 0.61: LX.2 L0.1
N$30
  Top 0.61: L0.2 C0.2
N$31
  Top 0.61: CX.1 LX.1 LM.2 CM.1
N$32  (via drill 0.5)
  other vias: 30.23,75.82
N$33  (via drill 0.5)
  other vias: 31.5,75.82
N$39  (via drill 0.5)
  other vias: 31.5,74.55
N$40  (via drill 0.5)
  other vias: 30.23,74.55
PGOOD  (via drill 0.5, 0.55)
  Top 0.203: R3.2 33.69,17.31 34.04,17.65 v34.04,18.16 | U1.7 33.39,22.75 33.78,22.35 v33.78,22.23
  Bottom 0.203: J3.4 60.07,5.33 59.56,5.84 50.55,5.84 48.9,7.49 48.9,20.7 47.37,22.23 v33.78,22.23 33.4,21.84 33.4,21.46 34.04,20.83 v34.04,18.16
RADIO_EN  (via drill 0.5)
  Top 0.203: J5.2 20.95,82.3 22.95,80.3 R21.1 25.15,79.25 v27.3,77.09 27.3,76.45 27.57,76.18 U4.1
  Top 0.254: v36.2,72.26 51.18,72.26 52.32,71.12 52.32,60.45 51.18,59.31 JP20.1
  Bottom 0.203: v27.3,77.09 27.69,77.47 31.62,77.47 32.89,76.2 32.89,75.56 v36.2,72.26
RADIO_GPIO1  (via drill 0.5)
  Top 0.203: JP19.1 51.18,56.52 52.83,58.17 52.83,71.37 51.05,73.15 v37.08,73.15 31.92,73.15 U4.10 31.86,71.01 32.26,70.61 33.78,70.61 34.16,70.23 R20.1
  Bottom 0.203: v37.08,73.15 31.11,79.12 31.11,83.31 30.35,84.07 24.64,84.07 23.5,85.22 J5.3
RADIO_MISO  (via drill 0.5)
  Top 0.203: U4.13 51.31,75.18 54.36,72.14 54.36,54.36 52.7,52.7 v52.7,48.77
  Bottom 0.203: v52.7,48.77 52.07,48.13 JP16.1
RADIO_MOSI  (via drill 0.5)
  Top 0.203: U4.14 51.44,75.68 54.86,72.26 54.86,53.98 53.59,52.7 v53.59,51.56
  Bottom 0.203: v53.59,51.56 52.96,50.93 JP17.1
RADIO_NIRQ  (via drill 0.5)
  Top 0.203: JP18.1 51.18,53.72 53.34,55.88 53.34,71.63 50.78,74.18 39.13,74.18 38.86,73.91 v37.97,73.91 37.08,73.91 36.81,74.18 U4.11
  Bottom 0.203: v37.97,73.91 32,79.88 32,83.69 31.11,84.58 26.54,84.58 26.04,85.09 J5.4
RADIO_NSS
  Top 0.203: U4.15 51.7,76.18 55.37,72.52 55.37,51.69 53.59,49.91 53.59,44.96 51.18,42.55 JP14.1
RADIO_SCLK
  Top 0.203: U4.12 51.05,74.68 53.85,71.88 53.85,54.74 51.82,52.7 51.82,45.97 51.18,45.34 JP15.1
REG_3.3V
  Top 0.406: IC1.1 IC1.2
  Top 0.508: IC1.2 73.62,42.55 C21.1
  Top 0.813: C21.1 C20.1 72.86,36.54 70.23,33.91 66.04,33.91 60.83,28.7 JP11.2
RF_IN
  Top 0.254: U2.1 26.1,62.54 26.04,62.61
  Top 1.626: 26.04,62.61 X1.1
RUN
  Top 0.203: U1.13 31.11,25.79 30.23,26.67 28.83,26.67 28.24,27.26 27,27.26 26.04,26.29 24.68,26.29 23.62,27.34 R2.2 R1.1
SER_D_N
  Top 0.406: R13.2 66.85,72.78 65.79,72.78 64.41,72.78 61.58,69.96 61.58,65.15 61.58,64.15 62.55,63.18 63.1,62.63 U6.16
SER_D_P
  Top 0.406: R16.2 66.85,72.25 65.79,72.25 64.63,72.25 62.12,69.74 62.12,65.15 62.12,64.37 62.93,63.56 63.21,63.28 U6.15
SPI1_MISO
  Top 0.203: U3.12 31.37,38.2 31.37,34.67 32.38,33.66 39.88,33.66 41.4,35.18 41.4,46.99 42.55,48.13 JP16.3 JP16.2
SPI1_MOSI
  Top 0.203: U3.13 31.86,34.81 32.64,34.04 39.62,34.04 41.02,35.43 41.02,49.4 42.55,50.93 JP17.3 JP17.2
SPI1_NSS
  Top 0.203: U3.10 30.36,34.81 30.35,34.8 30.35,34.54 32.02,32.88 40.37,32.88 41.85,34.35 42.16,34.67 42.16,42.04 42.67,42.55 JP14.3 JP14.2
SPI1_SCK
  Top 0.203: U3.11 30.86,34.67 32.26,33.27 40.13,33.27 41.78,34.92 41.78,44.58 42.55,45.34 JP15.3 JP15.2
SWCLK  (via drill 0.5)
  Top 0.203: U3.22 37.08,42.16 37.9,42.98 37.9,63.45 37.47,63.88 v37.47,65.02
  Bottom 0.203: J1.2 51.05,85.09 46.48,80.52 46.48,71.75 44.96,70.23 41.53,70.23 38.23,66.93 38.23,65.79 v37.47,65.02
SWDIO  (via drill 0.5)
  Top 0.203: U3.21 37.19,41.63 38.35,42.8 38.35,63.5 38.86,64.01 v38.86,65.02
  Bottom 0.203: J1.4 54.1,83.82 50.67,83.82 47.12,80.26 47.12,71.5 45.34,69.72 41.91,69.72 38.86,66.67 v38.86,65.02
USART2_RX
  Top 0.203: U3.20 32.8,41.15 37.34,41.15 38.84,42.65 38.84,62.71 42.55,66.42 JP8.3 JP8.2
USART2_TX
  Top 0.203: U3.19 37.46,40.63 39.29,42.47 39.29,60.38 42.55,63.63 JP9.3 JP9.2
USB_DM
  Top 0.305: J2.D-1 82.41,50.15 82.11,49.85 CR1.1
USB_DP
  Top 0.305: J2.D+1 82.55,50.8 81.6,51.75 CR1.3
USB_VBUS  (via drill 0.6)
  Top 0.305: J2.VBUS1 82.65,49.5 82.04,48.9 v81.28,48.9
  Top 0.406: C14.1 76.2,60.2 75.82,59.82 75.82,59.05 76.14,58.73 U7.1 78.3,58.73 78.61,58.42 78.61,57.15 78.3,56.84 U7.3 76.27,56.84 v75.95,56.52
  Top 0.508: CR1.5 v75.95,50.8
  Bottom 0.305: v81.28,48.9 77.85,48.9 v75.95,50.8
  Bottom 0.406: v75.95,50.8 75.95,51.94 74.68,53.21 74.68,56.01 75.18,56.52 v75.95,56.52
USBC_CC1
  Top 0.254: R14.1 75.31,69.72 77.36,71.77 U5.A5
USBC_CC2
  Top 0.254: U5.B5 81.06,73.32 82.17,74.42 82.17,76.83 81.03,77.98 77.98,77.98 76.29,77.98 75.14,79.12 R15.1
USBC_DN  (via drill 0.5)
  Top 0.254: U5.A7 76.71,72.77 76.01,73.47 | 76.01,73.47 CR2.3 | v76.2,73.28 76.01,73.47
  Bottom 0.254: v76.2,73.28 75.06,73.28 74.55,72.77 73.91,72.77 73.28,72.14 73.28,70.48 73.91,69.85 77.47,69.85 77.98,70.36 77.98,72.01 78.23,72.26 79.12,72.26 79.27,72.12 U5.B7
USBC_DP  (via drill 0.5)
  Top 0.254: U5.A6 76.71,72.26 76.01,71.57 | 76.01,71.57 CR2.1 | v76.2,71.75 76.01,71.57
  Bottom 0.254: v76.2,71.75 75.06,71.75 74.55,72.26 74.17,72.26 73.79,71.88 73.79,70.74 74.17,70.36 77.22,70.36 77.47,70.61 77.47,72.17 78.07,72.77 79.12,72.77 79.25,72.9 79.8,72.9 U5.B6
USBC_VBUS  (via drill 0.5, 0.6)
  Top 0.254: U5.A4 79.77,71.27 | 79.77,71.27 U5.B9 | C22.1 v75.18,75.44 76.86,73.77 U5.A9 79.77,73.77 U5.B4 79.25,73.15 79.25,71.88 79.77,71.36 79.77,71.27
  Top 0.305: CR2.5 v70.48,72.52
  Bottom 0.305: U5.B4 76.91,73.72 v75.18,75.44
  Bottom 0.813: v75.18,75.44 73.41,75.44 v70.48,72.52 70.48,53.85 78.61,45.72 78.61,29.21 77.34,27.94 73.28,27.94 70.48,25.15 70.48,17.91 66.42,13.84 JP12.2
VAUX_3.3V
  Top 1.016: X7.2 67.06,31.11 63.63,27.69 JP10.2
VAUX_5V
  Top 1.016: JP13.2 69.22,14.73 70.74,16.26 X6.4 X6.3
VCC  (via drill 0.5)
  Top 0.203: U1.5 U1.4 | U1.8 U1.9 v33.78,23.75
  Top 0.254: U1.5 31.62,22.08 v31.62,21.08
  Top 0.406: C4.1 v25.27,27.18
  Bottom 0.203: J3.5 62.61,5.33 61.47,6.48 51.05,6.48 49.66,7.87 49.66,20.95 47.88,22.73 34.8,22.73 v33.78,23.75
  pour Route15 (isolate 0.254): 25.27,28.07 24.89,28.07 24.51,27.69 24.51,21.46 25.65,20.32 34.29,20.32 34.92,20.95 34.92,26.16 33.53,27.56 33.02,28.07
VIN  (via drill 0.65)
  Top 0.203: U1.16 29.61,25.38 29.46,25.53 28.07,25.53 v27.69,25.15 | JP1.1 53.85,10.92 53.85,7.75 54.99,6.6 J3.2
  Bottom 0.61: v27.69,25.15 26.92,25.15 26.42,25.65 26.42,27.94 27.84,29.37 32.23,29.37 37.08,24.51 48.9,24.51 52.45,20.95 JP1.1
VOUT  (via drill 0.5)
  Top 0.254: U1.2 30.11,21.6 v29.59,21.08
  Top 0.406: C6.1 31.16,19.01
  Top 0.61: R3.1 31.16,19.01 C6.1 C5.1
  Top 0.813: v31.11,20.07 C6.1 | JP3.2 55.24,19.68 51.31,23.62 37.47,23.62 32.89,19.05 R3.1
  Bottom 0.813: v31.11,20.07 30.1,20.07 29.59,20.57 v29.59,21.08
VSOLAR
  Top 0.254: R1.2 20.41,29.93 19.67,29.2 19.67,18.29 20.45,17.52 C7.1
  Top 0.813: SC2.1 17.69,15.03 18.54,15.88 21.46,15.88 | 21.46,15.88 42.67,15.88 48.77,9.78 JP1.2 | C7.1 21.46,15.88
  Top 2.54: SC2.1 SC1.1
VSTORAGE
  Top 0.203: JP2.2 56.64,10.92 56.64,7.75 57.53,6.86 J3.3
  Top 0.406: C3.1 27.09,28.07 D2.3 31.58,28.07 R9.2
  Top 0.61: R9.2 31.75,27.43 33.19,26 C1.1 52.49,26 58.04,20.45 JP2.2

### Text on the board
tNames: HABEXpico / Dev Board / By: Arko